# Altium project IRS_unitcell1.PrjPcb
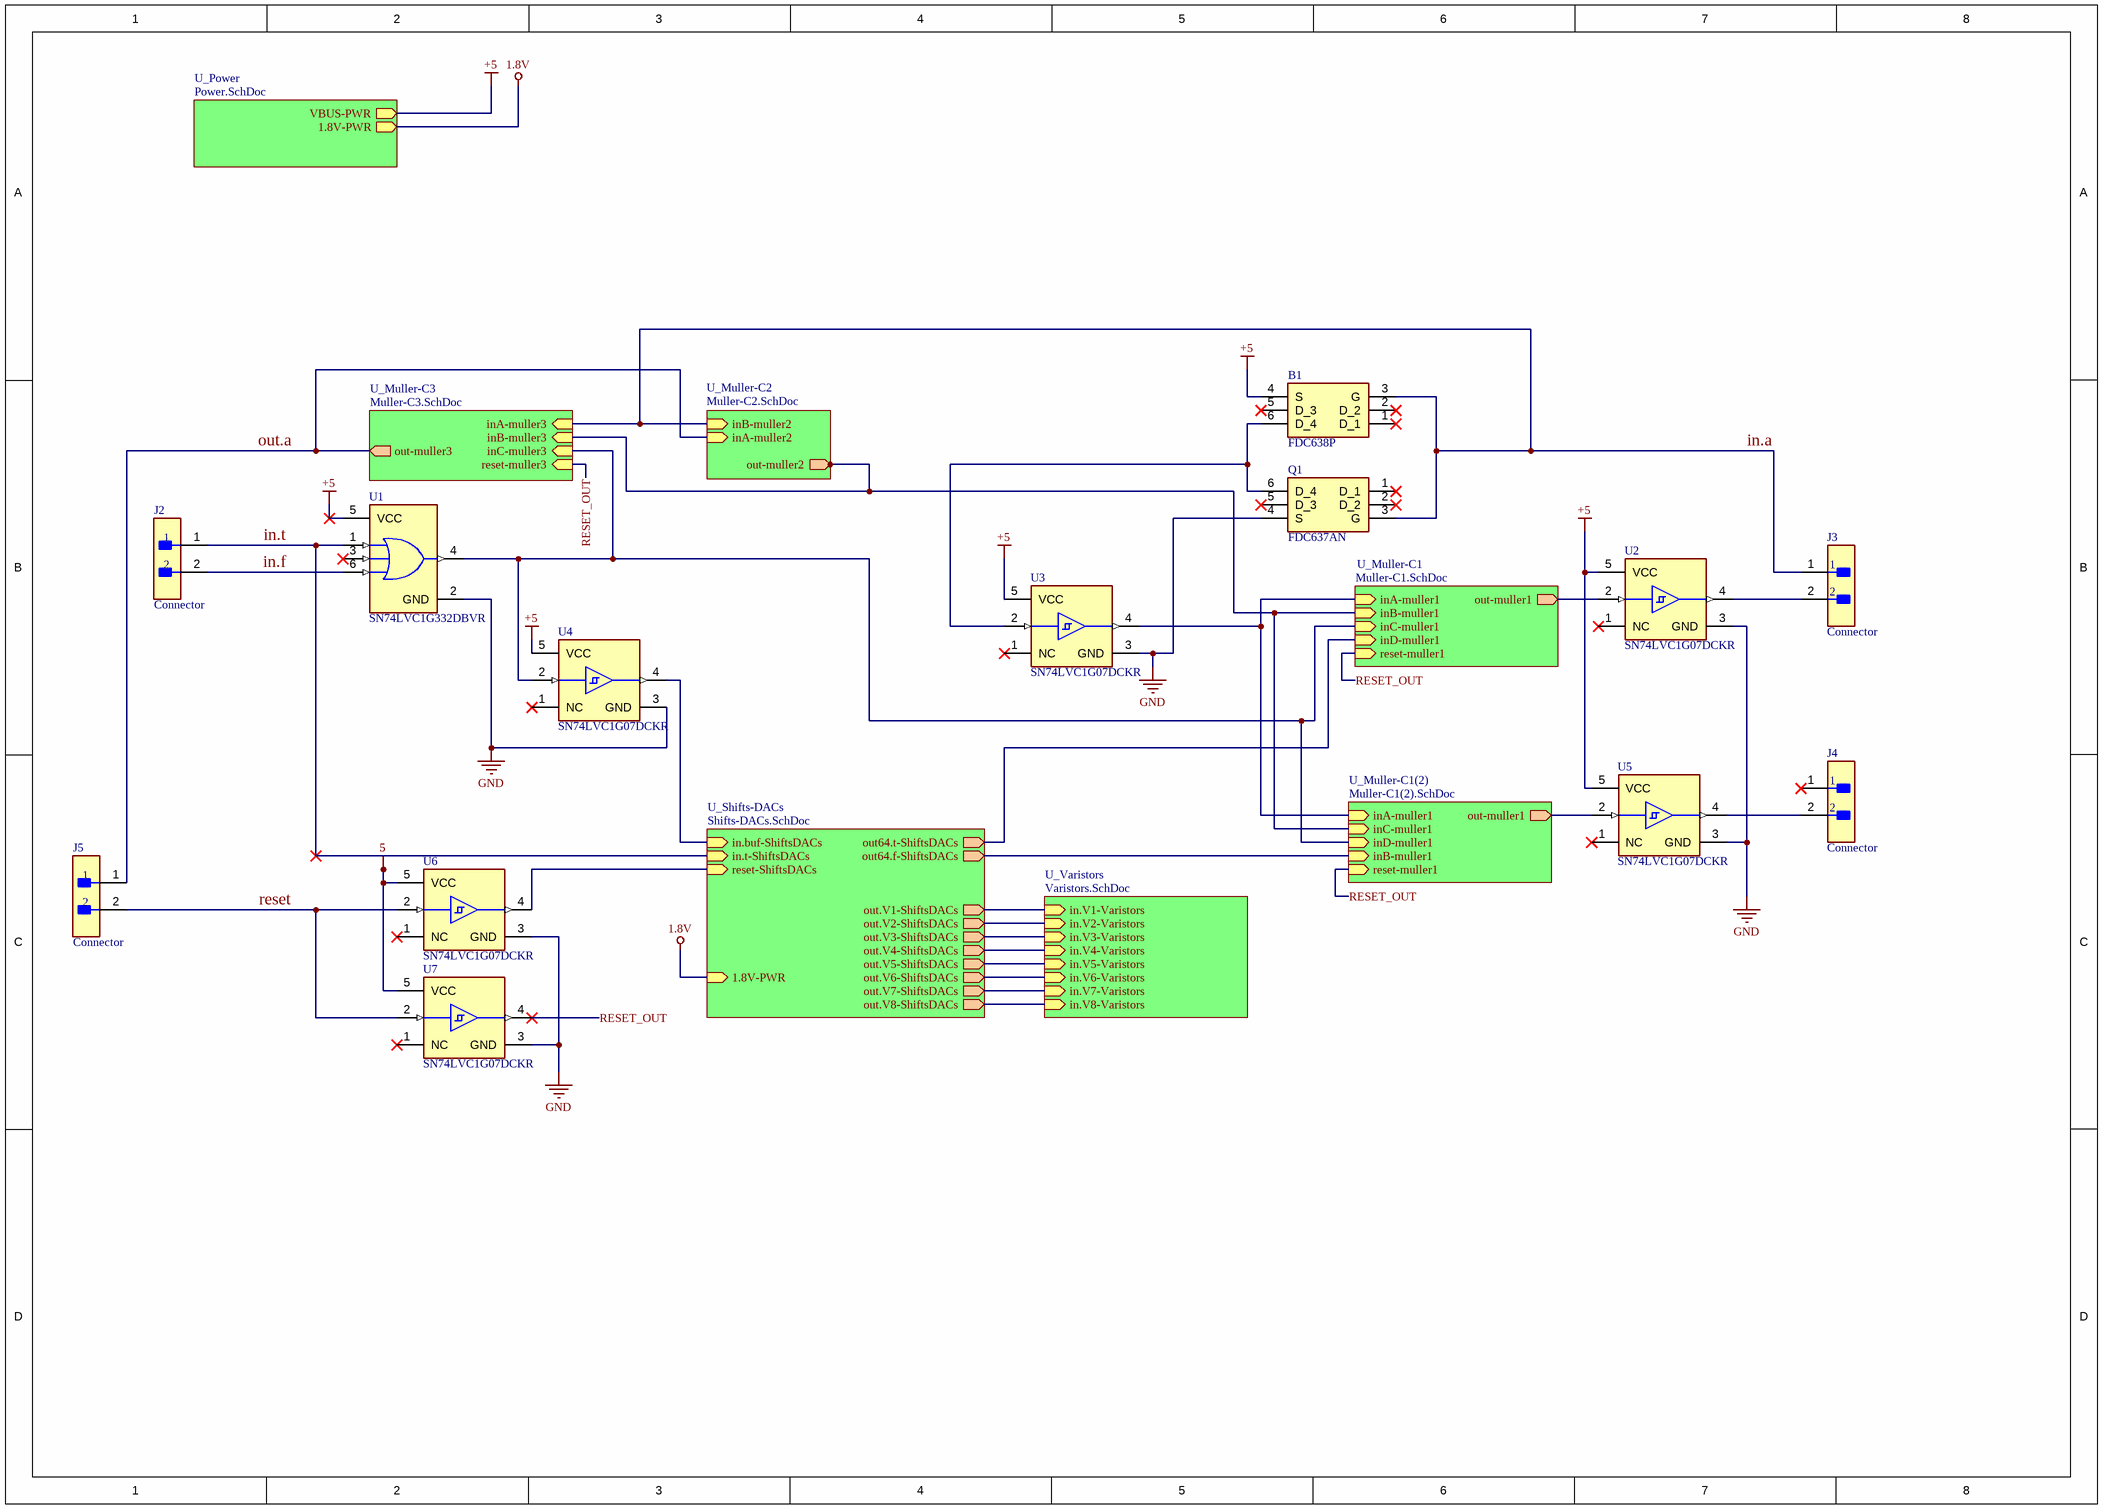
[diagram p0: Main.SchDoc]
8 sheets, 101 parts. Net scope: hierarchical (ports join the sheet entries above them; power ports are global).
Board files: IRS_ControlPCB.PcbDoc, IRS_ControlPCB - Copy.PcbDoc
Sheets:
  Main.SchDoc
    U_Muller-C1 = Muller-C1.SchDoc
    U_Muller-C2 = Muller-C2.SchDoc
    U_Muller-C3 = Muller-C3.SchDoc
    U_Shifts-DACs = Shifts-DACs.SchDoc
    U_Muller-C1(2) = Muller-C1(2).SchDoc
    U_Power = Power.SchDoc
    U_Varistors = Varistors.SchDoc

## Sheet Main.SchDoc
size A3

### Parts
B1  FDC638P  [SOT95P275X110-6N]
J2  Connector  [FP-B2B-XH-A_LF_SN-MFG]
J3  Connector  [FP-B2B-XH-A_LF_SN-MFG]
J4  Connector  [FP-B2B-XH-A_LF_SN-MFG]
J5  Connector  [FP-B2B-XH-A_LF_SN-MFG]
Q1  FDC637AN  [SOT95P275X110-6N]
U1  SN74LVC1G332DBVR  [FP-DBV0006A-MFG]
U2  SN74LVC1G07DCKR  [FP-DCK0005A-MFG]
U3  SN74LVC1G07DCKR  [FP-DCK0005A-MFG]
U4  SN74LVC1G07DCKR  [FP-DCK0005A-MFG]
U5  SN74LVC1G07DCKR  [FP-DCK0005A-MFG]
U6  SN74LVC1G07DCKR  [FP-DCK0005A-MFG]
U7  SN74LVC1G07DCKR  [FP-DCK0005A-MFG]

### Sub-sheets
U_Muller-C1 = Muller-C1.SchDoc: out-muller1 (out), inA-muller1 (in), inB-muller1 (in), inC-muller1 (in), inD-muller1 (in), reset-muller1 (in)
U_Muller-C1(2) = Muller-C1(2).SchDoc: out-muller1 (out), inA-muller1 (in), inC-muller1 (in), inD-muller1 (in), inB-muller1 (in), reset-muller1 (in)
U_Muller-C2 = Muller-C2.SchDoc: out-muller2 (out), inB-muller2 (in), inA-muller2 (in)
U_Muller-C3 = Muller-C3.SchDoc: inA-muller3 (in), inB-muller3 (in), inC-muller3 (in), out-muller3 (out), reset-muller3 (in)
U_Power = Power.SchDoc: VBUS-PWR (out), 1.8V-PWR (out)
U_Shifts-DACs = Shifts-DACs.SchDoc: in.t-ShiftsDACs (in), in.buf-ShiftsDACs (in), reset-ShiftsDACs (in), out64.t-ShiftsDACs (out), out64.f-ShiftsDACs (out), out.V1-ShiftsDACs (out), out.V2-ShiftsDACs (out), out.V3-ShiftsDACs (out), out.V4-ShiftsDACs (out), out.V5-ShiftsDACs (out), out.V6-ShiftsDACs (out), out.V7-ShiftsDACs (out), out.V8-ShiftsDACs (out), 1.8V-PWR (in)
U_Varistors = Varistors.SchDoc: in.V1-Varistors (in), in.V2-Varistors (in), in.V3-Varistors (in), in.V4-Varistors (in), in.V5-Varistors (in), in.V6-Varistors (in), in.V7-Varistors (in), in.V8-Varistors (in)

### Nets
1.8V: sheet U_Shifts-DACs/1.8V-PWR, sheet U_Power/1.8V-PWR
5: U6.5(VCC) U7.5(VCC)
+5: B1.4(S) U1.5(VCC) U2.5(VCC) U3.5(VCC) U4.5(VCC) U5.5(VCC) ; sheet U_Power/VBUS-PWR  [project net VBUS-USBC]
GND: Q1.4(S) U1.2(GND) U2.3(GND) U3.3(GND) U4.3(GND) U5.3(GND) U6.3(GND) U7.3(GND) ; sheet U_Shifts-DACs/out.V1-ShiftsDACs, sheet U_Shifts-DACs/out.V2-ShiftsDACs, sheet U_Shifts-DACs/out.V3-ShiftsDACs, sheet U_Shifts-DACs/out.V4-ShiftsDACs, sheet U_Shifts-DACs/out.V5-ShiftsDACs, sheet U_Shifts-DACs/out.V6-ShiftsDACs, sheet U_Shifts-DACs/out.V7-ShiftsDACs, sheet U_Shifts-DACs/out.V8-ShiftsDACs, sheet U_Varistors/in.V1-Varistors, sheet U_Varistors/in.V2-Varistors, sheet U_Varistors/in.V3-Varistors, sheet U_Varistors/in.V4-Varistors, sheet U_Varistors/in.V5-Varistors, sheet U_Varistors/in.V6-Varistors, sheet U_Varistors/in.V7-Varistors, sheet U_Varistors/in.V8-Varistors  [project net Dn-USBC]
in.a: B1.3(G) J3.1 Q1.3(G) ; sheet U_Muller-C2/inB-muller2, sheet U_Muller-C3/inA-muller3
in.f: J2.2 U1.6(C)
in.t: J2.1 U1.1(A) ; sheet U_Shifts-DACs/in.t-ShiftsDACs
out.a: J5.1 ; sheet U_Muller-C2/inA-muller2, sheet U_Muller-C3/out-muller3
reset: J5.2 U6.2(A) U7.2(A)
RESET_OUT: U7.4(Y) ; sheet U_Muller-C1/reset-muller1, sheet U_Muller-C3/reset-muller3, sheet U_Muller-C1(2)/reset-muller1
NetB1_6: B1.6(D_4) Q1.6(D_4) U3.2(A)
NetB2_3: U3.4(Y) ; sheet U_Muller-C1/inA-muller1, sheet U_Muller-C1(2)/inA-muller1
NetB4_3: sheet U_Muller-C1/inB-muller1, sheet U_Muller-C2/out-muller2, sheet U_Muller-C3/inB-muller3, sheet U_Muller-C1(2)/inC-muller1
NetB5_3: U2.2(A) ; sheet U_Muller-C1/out-muller1
NetB7_3: U1.4(Y) U4.2(A) ; sheet U_Muller-C1/inC-muller1, sheet U_Muller-C3/inC-muller3, sheet U_Muller-C1(2)/inD-muller1
NetB8_3: sheet U_Muller-C1/inD-muller1, sheet U_Shifts-DACs/out64.t-ShiftsDACs
NetB21_3: U6.4(Y) ; sheet U_Shifts-DACs/reset-ShiftsDACs
NetB24_3: sheet U_Shifts-DACs/out64.f-ShiftsDACs, sheet U_Muller-C1(2)/inB-muller1
NetB25_3: U5.2(A) ; sheet U_Muller-C1(2)/out-muller1
NetJ3_2: J3.2 U2.4(Y)
NetJ4_2: J4.2 U5.4(Y)
NetU4_4: U4.4(Y) ; sheet U_Shifts-DACs/in.buf-ShiftsDACs

Not connected (* = marked no-connect by the designer): B1 1(D_1)* 2(D_2)* 5(D_3)*; J4 1*; Q1 1(D_1)* 2(D_2)* 5(D_3)*; U1 3(B)*; U2 1(NC)*; U3 1(NC)*; U4 1(NC)*; U5 1(NC)*; U6 1(NC)*; U7 1(NC)*

### Library data of the parts
B1 = CMP-007-000000-1: Low gate charge (10 nC typical); Manufacturer_Name: onsemi; Geometry.Height: 1.1mm; Datasheet Link: https://www.onsemi.com/pub/Collateral/FDC638P-D.PDF; Arrow Price/Stock: *; Design Item ID: FDC638P; Mouser Part Number: 512-FDC638P; Manufacturer_Part_Number: FDC638P; Mouser Price/Stock: https://www.mouser.co.uk/ProductDetail/onsemi-Fairchild/FDC638P?qs=FOlmdCx%252BAA16kOuf%252Brkheg%3D%3D; Source: FDC638P.SchLib; Arrow Part Number: *
J2-J5 = CMP-2000-05888-3: B2B-XH-A(LF)(SN) CONN HEADER VERT 2POS 2.5MM; Current Rating: 3A; Voltage Rating: 250V; Number of Contacts: 2; Contact Resistance: 20mR; Wire/Cable Gauge: 22AWG; Insulation Resistance: 1GR; Connector Type: Male Pin; Packaging: Bulk; Contact Material: Brass; Lead Free: Lead Free; Orientation: Straight; Contact Plating: Tin; Max Current Rating: 3A; Termination: Solder; Fastening Type: Detent; Depth: 5.75mm; Housing Material: Polyamide; REACH SVHC: No SVHC; Series: XH; Voltage Rating (AC): 250V; Number of Positions: 2; Color: Natural; Contact Type: Male Pin; Max Voltage Rating (DC): 250V; Pitch: 2.5mm; Lead Pitch: 2.5mm; Mount: Through Hole; Max Operating Temperature: 85°C; Length: 7.4mm; Max Voltage Rating (AC): 250V; Min Operating Temperature: -25°C; Number of Rows: 1; Housing Color: White
Q1 = CMP-005-000000-4: Low gate charge (10.5nC typical).; Manufacturer_Name: onsemi; Geometry.Height: 1.1mm; Mouser Part Number: 512-FDC637AN; Source: FDC637AN.SchLib; Arrow Part Number: FDC637AN; Datasheet Link: https://www.onsemi.com/pub/Collateral/FDC637AN-D.PDF; Arrow Price/Stock: https://www.arrow.com/en/products/fdc637an/on-semiconductor?region=nac; Manufacturer_Part_Number: FDC637AN; Mouser Price/Stock: https://www.mouser.co.uk/ProductDetail/ON-Semiconductor-Fairchild/FDC637AN?qs=utFvTgNEmG6iAEUdTAueXw%3D%3D; Design Item ID: FDC637AN
U1 = CMP-0859-00188-4: IC GATE OR 1CH 3-INP SOT23-6; Manufacturer: TEXAS INSTRUMENTS; Number Of Inputs: 3; Nominal Supply Current: 10-500uA; Number Of Circuits: 1; Max Supply Voltage: 5.5V; Standoff Height: 0mm; Propagation Delay: 4.5ns; Min Supply Voltage: 1.5V; Height: 1.45mm; Temperature Range High: +125°C; Device Class L3: Logic Gates; Device Class L2: Logic ICs; Lead Free: Yes; Temperature Range Low: -40°C; ComponentLink2URL: http://www.ti.com/lit/ds/symlink/sn74lvc1g332.pdf; Package: DBV0006A; ComponentLink2Description: Datasheet; Octopart: https://octopart.com/sn74lvc1g332dbvr-texas+instruments-464996; Category: IC; Automotive: No; Manufacturer Part Number: SN74LVC1G332DBVR; Ipc Land Pattern Name: SOT95P280X145-6; Logic Function Desc: OR; Ambient Temperature Range Low: -40°C; Temperature: -40°C to +125°C; Number Of Outputs: 1; Mouser Description: Logic Gates Sngl 3 Inpt + OR Gt; RoHS: TRUE; Ambient Temperature Range High: +125°C; Device Class L1: Integrated Circuits (ICs); Digikey Description: IC GATE OR 1CH 3-INP SOT23-6
U2-U7 = CMP-00023-00004-1: Buffer, LVC/LCX/Z Series, 1-Func, 1-Input, CMOS, PDSO5; Min Operating Temperature: -40°C; Pins: 5; Case/Package: TSSOP; Max Operating Temperature: 125°C; RoHS Compliant: Yes

## Sheet Muller-C1.SchDoc
size 429 x 344 mm
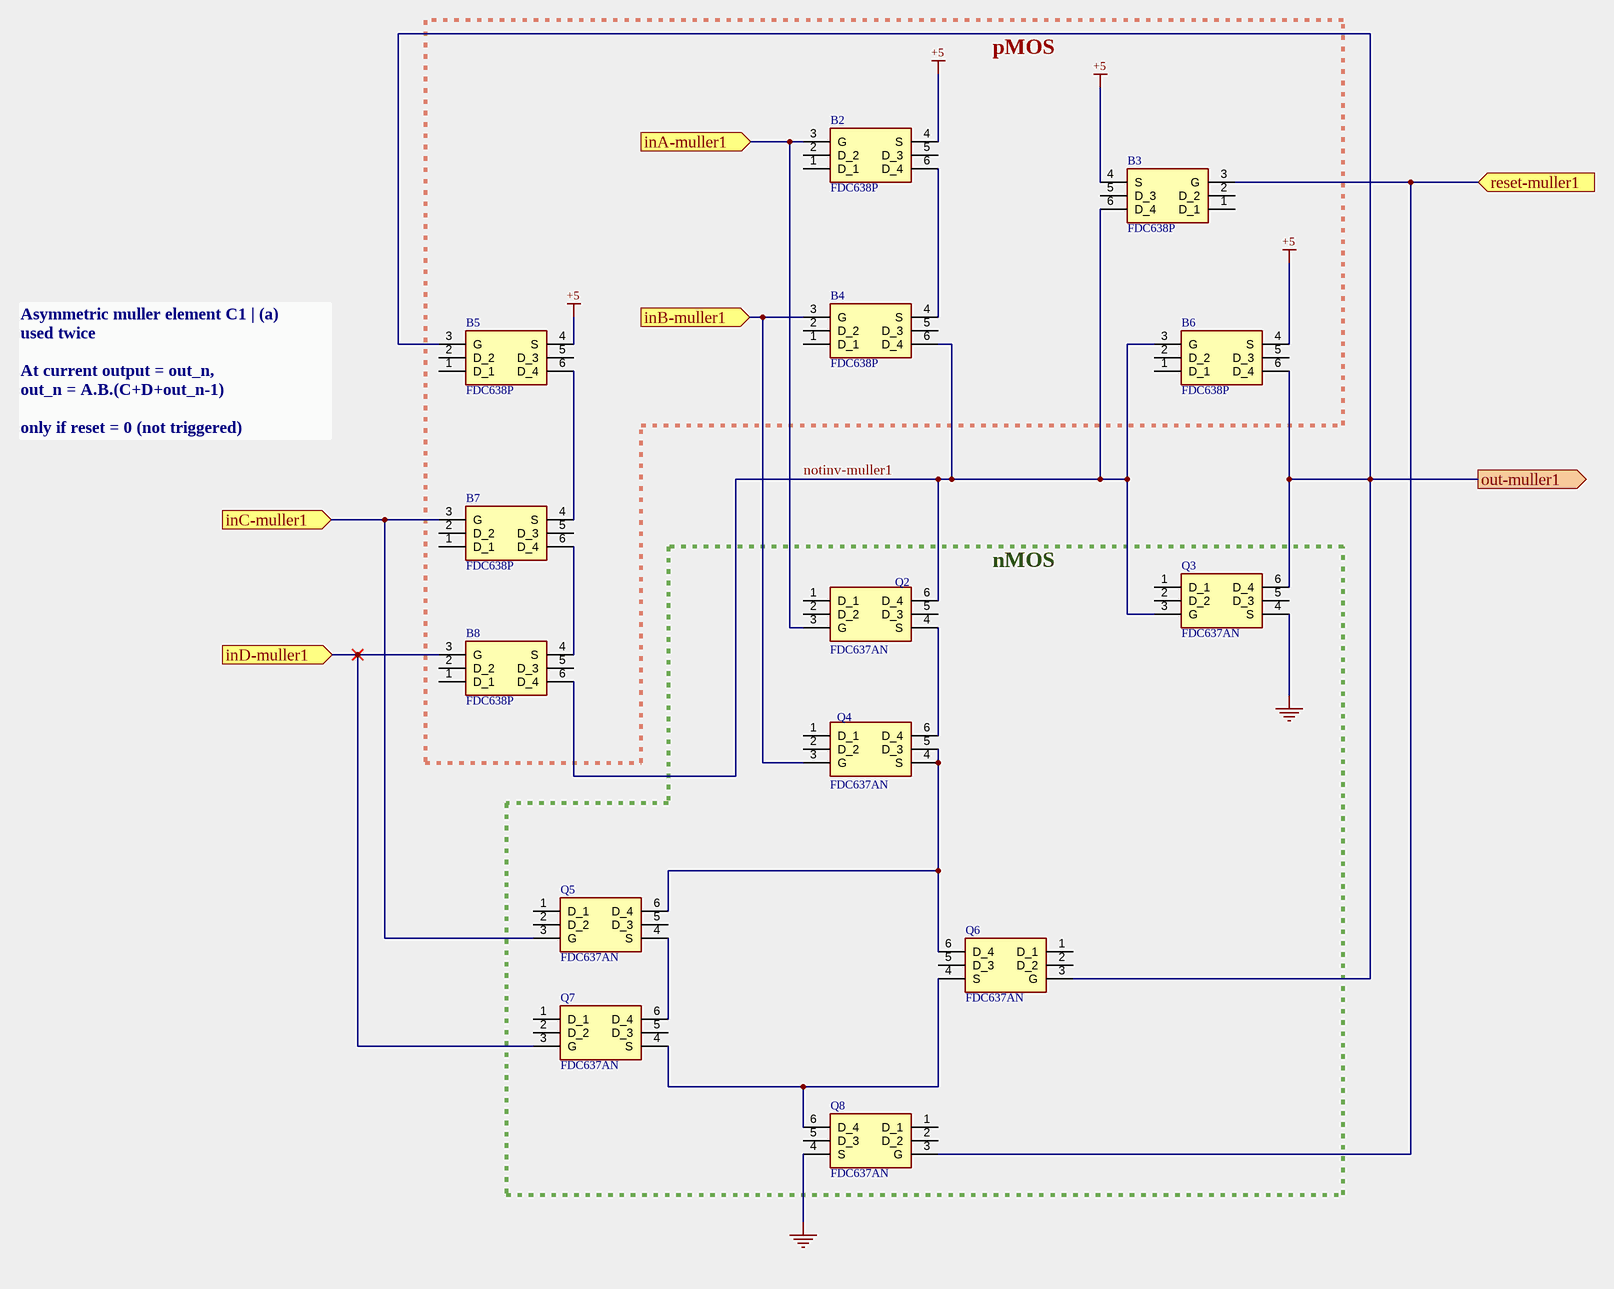
[diagram p1: Muller-C1.SchDoc]

### Parts
B2  FDC638P  [SOT95P275X110-6N]
B3  FDC638P  [SOT95P275X110-6N]
B4  FDC638P  [SOT95P275X110-6N]
B5  FDC638P  [SOT95P275X110-6N]
B6  FDC638P  [SOT95P275X110-6N]
B7  FDC638P  [SOT95P275X110-6N]
B8  FDC638P  [SOT95P275X110-6N]
Q2  FDC637AN  [SOT95P275X110-6N]
Q3  FDC637AN  [SOT95P275X110-6N]
Q4  FDC637AN  [SOT95P275X110-6N]
Q5  FDC637AN  [SOT95P275X110-6N]
Q6  FDC637AN  [SOT95P275X110-6N]
Q7  FDC637AN  [SOT95P275X110-6N]
Q8  FDC637AN  [SOT95P275X110-6N]

### Blocks framed on the sheet
pMOS: B2-B8
nMOS: Q2-Q8

### Ports
inA-muller1 (in), inB-muller1 (in), inC-muller1 (in), inD-muller1 (in), out-muller1 (out), reset-muller1 (in)

### Nets
+5: B2.4(S) B3.4(S) B5.4(S) B6.4(S)  [project net VBUS-USBC]
GND: Q3.4(S) Q8.4(S)  [project net Dn-USBC]
notinv-muller1: B3.6(D_4) B4.6(D_4) B6.3(G) B8.6(D_4) Q2.6(D_4) Q3.3(G)
RESET_OUT: B3.3(G) Q8.3(G) ; port reset-muller1
NetB2_3: B2.3(G) Q2.3(G) ; port inA-muller1
NetB2_6: B2.6(D_4) B4.4(S)
NetB4_3: B4.3(G) Q4.3(G) ; port inB-muller1
NetB5_3: B5.3(G) B6.6(D_4) Q3.6(D_4) Q6.3(G) ; port out-muller1
NetB5_6: B5.6(D_4) B7.4(S)
NetB7_3: B7.3(G) Q5.3(G) ; port inC-muller1
NetB7_6: B7.6(D_4) B8.4(S)
NetB8_3: B8.3(G) Q7.3(G) ; port inD-muller1
NetQ2_4: Q2.4(S) Q4.6(D_4)
NetQ4_4: Q4.4(S) Q4.5(D_3) Q5.6(D_4) Q6.6(D_4)
NetQ5_4: Q5.4(S) Q7.6(D_4)
NetQ6_4: Q6.4(S) Q7.4(S) Q8.6(D_4)

Not connected (* = marked no-connect by the designer): B2 1(D_1) 2(D_2) 5(D_3); B3 1(D_1) 2(D_2) 5(D_3); B4 1(D_1) 2(D_2) 5(D_3); B5 1(D_1) 2(D_2) 5(D_3); B6 1(D_1) 2(D_2) 5(D_3); B7 1(D_1) 2(D_2) 5(D_3); B8 1(D_1) 2(D_2) 5(D_3); Q2 1(D_1) 2(D_2) 5(D_3); Q3 1(D_1) 2(D_2) 5(D_3); Q4 1(D_1) 2(D_2); Q5 1(D_1) 2(D_2) 5(D_3); Q6 1(D_1) 2(D_2) 5(D_3); Q7 1(D_1) 2(D_2) 5(D_3); Q8 1(D_1) 2(D_2) 5(D_3)

### Notes on the sheet
- Asymmetric muller element C1 | (a)
  used twice
  At current output = out_n,
  out_n = A.B.(C+D+out_n-1)
  only if reset = 0 (not triggered)

### Library data of the parts
B2-B8 = CMP-007-000000-1: as B1 on sheet Main; Datasheet Link: https://www.onsemi.com/pub/Collateral/FDC638P-D.PDF; Arrow Price/Stock: *; Design Item ID: FDC638P; Mouser Part Number: 512-FDC638P; Manufacturer_Part_Number: FDC638P; Mouser Price/Stock: https://www.mouser.co.uk/ProductDetail/onsemi-Fairchild/FDC638P?qs=FOlmdCx%252BAA16kOuf%252Brkheg%3D%3D; Source: FDC638P.SchLib; Arrow Part Number: *
Q2-Q8 = CMP-005-000000-4: as Q1 on sheet Main; Mouser Part Number: 512-FDC637AN; Source: FDC637AN.SchLib; Arrow Part Number: FDC637AN; Datasheet Link: https://www.onsemi.com/pub/Collateral/FDC637AN-D.PDF; Arrow Price/Stock: https://www.arrow.com/en/products/fdc637an/on-semiconductor?region=nac; Manufacturer_Part_Number: FDC637AN; Mouser Price/Stock: https://www.mouser.co.uk/ProductDetail/ON-Semiconductor-Fairchild/FDC637AN?qs=utFvTgNEmG6iAEUdTAueXw%3D%3D; Design Item ID: FDC637AN

## Sheet Muller-C2.SchDoc
size 419 x 208 mm
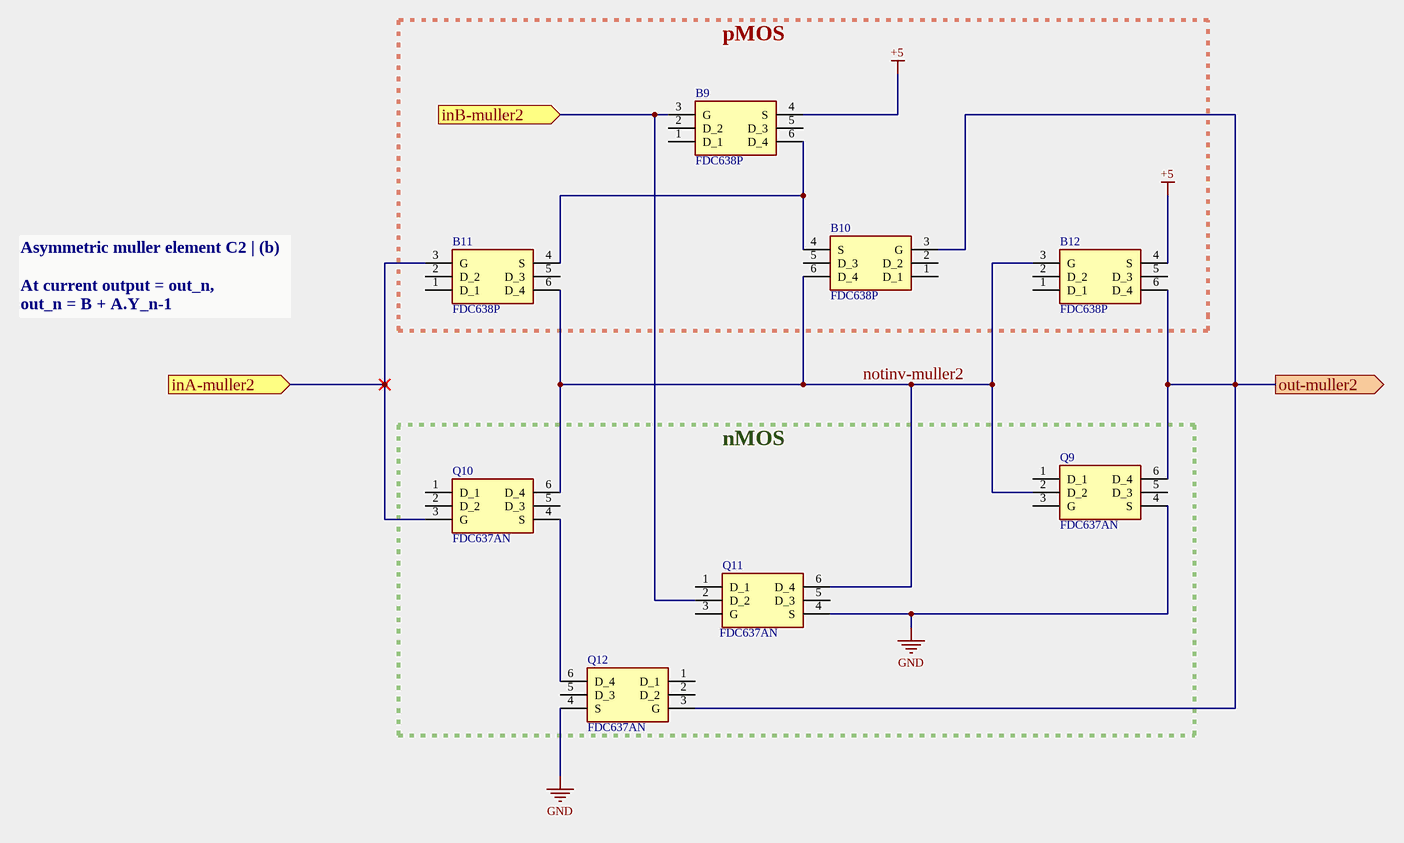
[diagram p2: Muller-C2.SchDoc]

### Parts
B9  FDC638P  [SOT95P275X110-6N]
B10  FDC638P  [SOT95P275X110-6N]
B11  FDC638P  [SOT95P275X110-6N]
B12  FDC638P  [SOT95P275X110-6N]
Q9  FDC637AN  [SOT95P275X110-6N]
Q10  FDC637AN  [SOT95P275X110-6N]
Q11  FDC637AN  [SOT95P275X110-6N]
Q12  FDC637AN  [SOT95P275X110-6N]

### Blocks framed on the sheet
pMOS: B9-B12
nMOS: Q9-Q12

### Ports
inA-muller2 (in), inB-muller2 (in), out-muller2 (out)

### Nets
+5: B9.4(S) B12.4(S)  [project net VBUS-USBC]
GND: Q9.4(S) Q11.4(S) Q12.4(S)  [project net Dn-USBC]
in.a: B9.3(G) Q11.2(D_2) ; port inB-muller2
notinv-muller2: B10.6(D_4) B11.6(D_4) B12.3(G) Q9.2(D_2) Q10.6(D_4) Q11.6(D_4)
out.a: B11.3(G) Q10.3(G) ; port inA-muller2
NetB4_3: B10.3(G) B12.6(D_4) Q9.6(D_4) Q12.3(G) ; port out-muller2
NetB9_6: B9.6(D_4) B10.4(S) B11.4(S)
NetQ10_4: Q10.4(S) Q12.6(D_4)

Not connected (* = marked no-connect by the designer): B9 1(D_1) 2(D_2) 5(D_3); B10 1(D_1) 2(D_2) 5(D_3); B11 1(D_1) 2(D_2) 5(D_3); B12 1(D_1) 2(D_2) 5(D_3); Q9 1(D_1) 3(G) 5(D_3); Q10 1(D_1) 2(D_2) 5(D_3); Q11 1(D_1) 3(G) 5(D_3); Q12 1(D_1) 2(D_2) 5(D_3)

### Notes on the sheet
- Asymmetric muller element C2 | (b)
  At current output = out_n,
  out_n = B + A.Y_n-1

### Library data of the parts
B9-B12 = CMP-007-000000-1: as B1 on sheet Main; Datasheet Link: https://www.onsemi.com/pub/Collateral/FDC638P-D.PDF; Arrow Price/Stock: *; Design Item ID: FDC638P; Mouser Part Number: 512-FDC638P; Manufacturer_Part_Number: FDC638P; Mouser Price/Stock: https://www.mouser.co.uk/ProductDetail/onsemi-Fairchild/FDC638P?qs=FOlmdCx%252BAA16kOuf%252Brkheg%3D%3D; Source: FDC638P.SchLib; Arrow Part Number: *
Q9-Q12 = CMP-005-000000-4: as Q1 on sheet Main; Mouser Part Number: 512-FDC637AN; Source: FDC637AN.SchLib; Arrow Part Number: FDC637AN; Datasheet Link: https://www.onsemi.com/pub/Collateral/FDC637AN-D.PDF; Arrow Price/Stock: https://www.arrow.com/en/products/fdc637an/on-semiconductor?region=nac; Manufacturer_Part_Number: FDC637AN; Mouser Price/Stock: https://www.mouser.co.uk/ProductDetail/ON-Semiconductor-Fairchild/FDC637AN?qs=utFvTgNEmG6iAEUdTAueXw%3D%3D; Design Item ID: FDC637AN

## Sheet Muller-C3.SchDoc
size 425 x 409 mm
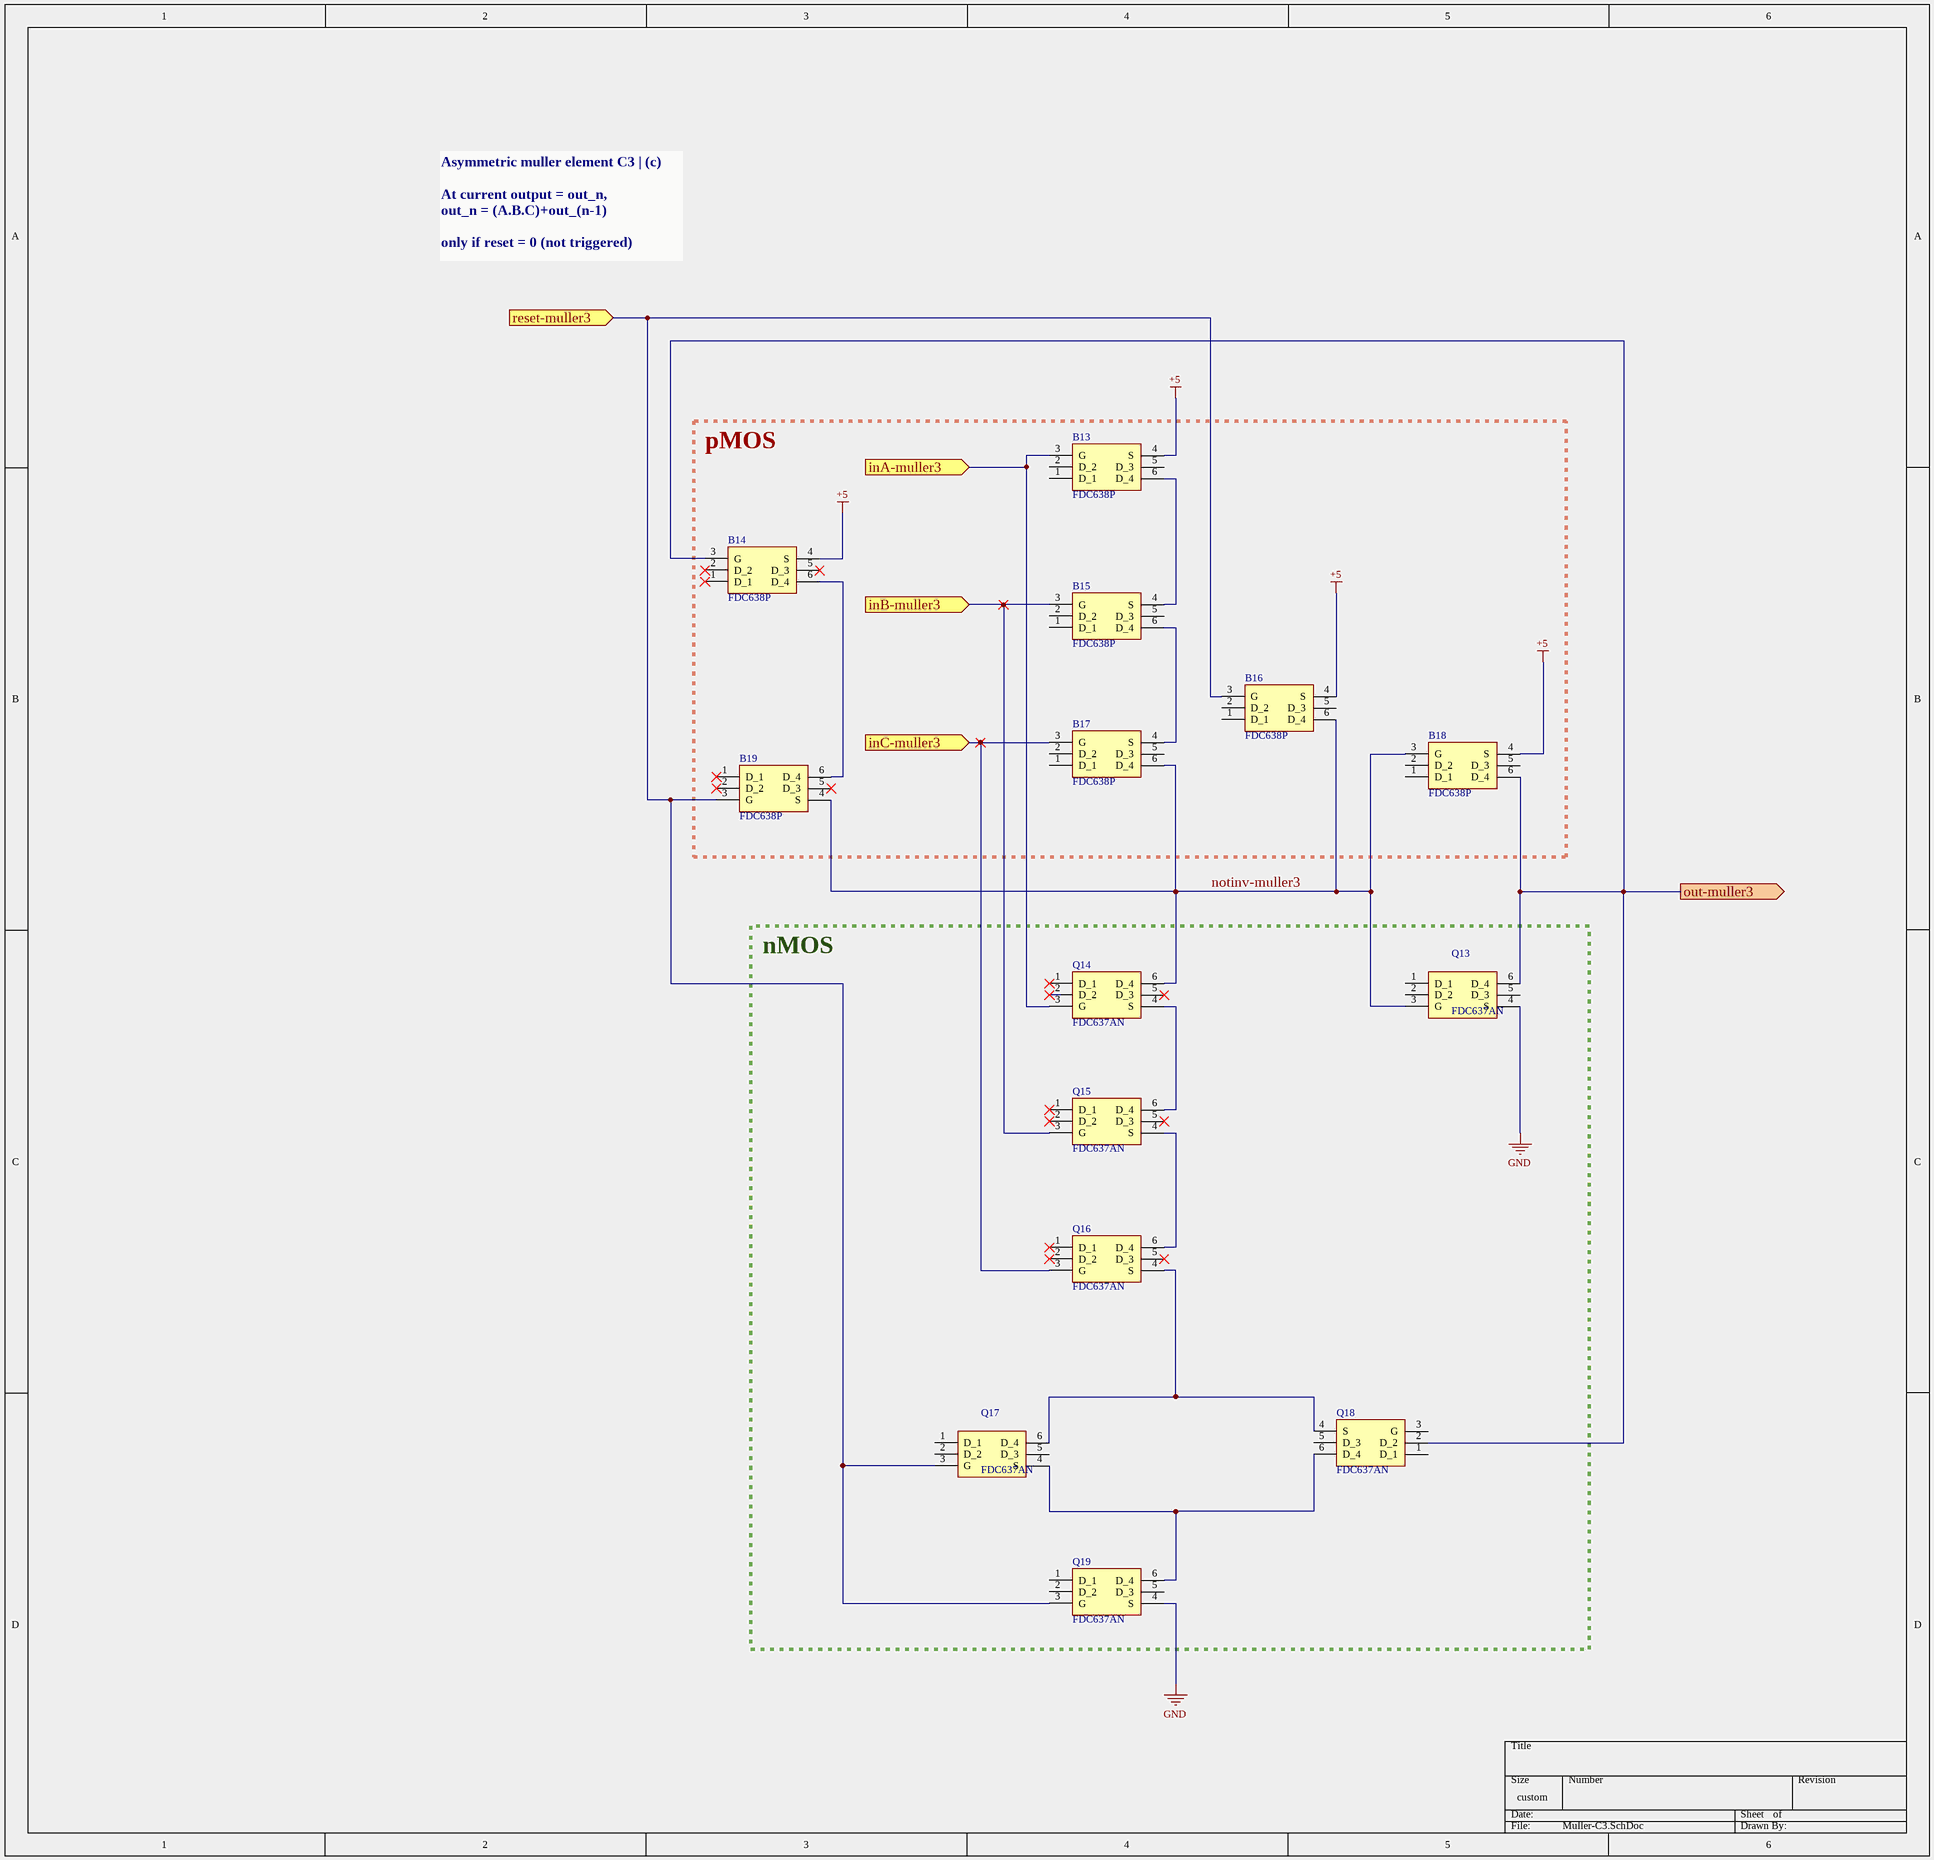
[diagram p3: Muller-C3.SchDoc]

### Parts
B13  FDC638P  [SOT95P275X110-6N]
B14  FDC638P  [SOT95P275X110-6N]
B15  FDC638P  [SOT95P275X110-6N]
B16  FDC638P  [SOT95P275X110-6N]
B17  FDC638P  [SOT95P275X110-6N]
B18  FDC638P  [SOT95P275X110-6N]
B19  FDC638P  [SOT95P275X110-6N]
Q13  FDC637AN  [SOT95P275X110-6N]
Q14  FDC637AN  [SOT95P275X110-6N]
Q15  FDC637AN  [SOT95P275X110-6N]
Q16  FDC637AN  [SOT95P275X110-6N]
Q17  FDC637AN  [SOT95P275X110-6N]
Q18  FDC637AN  [SOT95P275X110-6N]
Q19  FDC637AN  [SOT95P275X110-6N]

### Blocks framed on the sheet
pMOS: B13-B19
nMOS: Q13-Q19

### Ports
inA-muller3 (in), inB-muller3 (in), inC-muller3 (in), out-muller3 (out), reset-muller3 (in)

### Nets
+5: B13.4(S) B14.4(S) B16.4(S) B18.4(S)  [project net VBUS-USBC]
GND: Q13.4(S) Q19.4(S)  [project net Dn-USBC]
in.a: B13.3(G) Q14.3(G) ; port inA-muller3
notinv-muller3: B16.6(D_4) B17.6(D_4) B18.3(G) B19.4(S) Q13.3(G) Q14.6(D_4)
out.a: B14.3(G) B18.6(D_4) Q13.6(D_4) Q18.2(D_2) ; port out-muller3
RESET_OUT: B16.3(G) B19.3(G) Q17.3(G) Q19.3(G) ; port reset-muller3
NetB4_3: B15.3(G) Q15.3(G) ; port inB-muller3
NetB7_3: B17.3(G) Q16.3(G) ; port inC-muller3
NetB13_6: B13.6(D_4) B15.4(S)
NetB14_6: B14.6(D_4) B19.6(D_4)
NetB15_6: B15.6(D_4) B17.4(S)
NetQ14_4: Q14.4(S) Q15.6(D_4)
NetQ15_4: Q15.4(S) Q16.6(D_4)
NetQ16_4: Q16.4(S) Q17.6(D_4) Q18.4(S)
NetQ17_4: Q17.4(S) Q18.6(D_4) Q19.6(D_4)

Not connected (* = marked no-connect by the designer): B13 1(D_1) 2(D_2) 5(D_3); B14 1(D_1)* 2(D_2)* 5(D_3)*; B15 1(D_1) 2(D_2) 5(D_3); B16 1(D_1) 2(D_2) 5(D_3); B17 1(D_1) 2(D_2) 5(D_3); B18 1(D_1) 2(D_2) 5(D_3); B19 1(D_1)* 2(D_2)* 5(D_3)*; Q13 1(D_1) 2(D_2) 5(D_3); Q14 1(D_1)* 2(D_2)* 5(D_3)*; Q15 1(D_1)* 2(D_2)* 5(D_3)*; Q16 1(D_1)* 2(D_2)* 5(D_3)*; Q17 1(D_1) 2(D_2) 5(D_3); Q18 1(D_1) 3(G) 5(D_3); Q19 1(D_1) 2(D_2) 5(D_3)

### Notes on the sheet
- Asymmetric muller element C3 | (c)
  At current output = out_n,
  out_n = (A.B.C)+out_(n-1)
  only if reset = 0 (not triggered)

### Library data of the parts
B13-B19 = CMP-007-000000-1: as B1 on sheet Main; Datasheet Link: https://www.onsemi.com/pub/Collateral/FDC638P-D.PDF; Arrow Price/Stock: *; Design Item ID: FDC638P; Mouser Part Number: 512-FDC638P; Manufacturer_Part_Number: FDC638P; Mouser Price/Stock: https://www.mouser.co.uk/ProductDetail/onsemi-Fairchild/FDC638P?qs=FOlmdCx%252BAA16kOuf%252Brkheg%3D%3D; Source: FDC638P.SchLib; Arrow Part Number: *
Q13-Q19 = CMP-005-000000-4: as Q1 on sheet Main; Mouser Part Number: 512-FDC637AN; Source: FDC637AN.SchLib; Arrow Part Number: FDC637AN; Datasheet Link: https://www.onsemi.com/pub/Collateral/FDC637AN-D.PDF; Arrow Price/Stock: https://www.arrow.com/en/products/fdc637an/on-semiconductor?region=nac; Manufacturer_Part_Number: FDC637AN; Mouser Price/Stock: https://www.mouser.co.uk/ProductDetail/ON-Semiconductor-Fairchild/FDC637AN?qs=utFvTgNEmG6iAEUdTAueXw%3D%3D; Design Item ID: FDC637AN

## Sheet Shifts-DACs.SchDoc
size A2
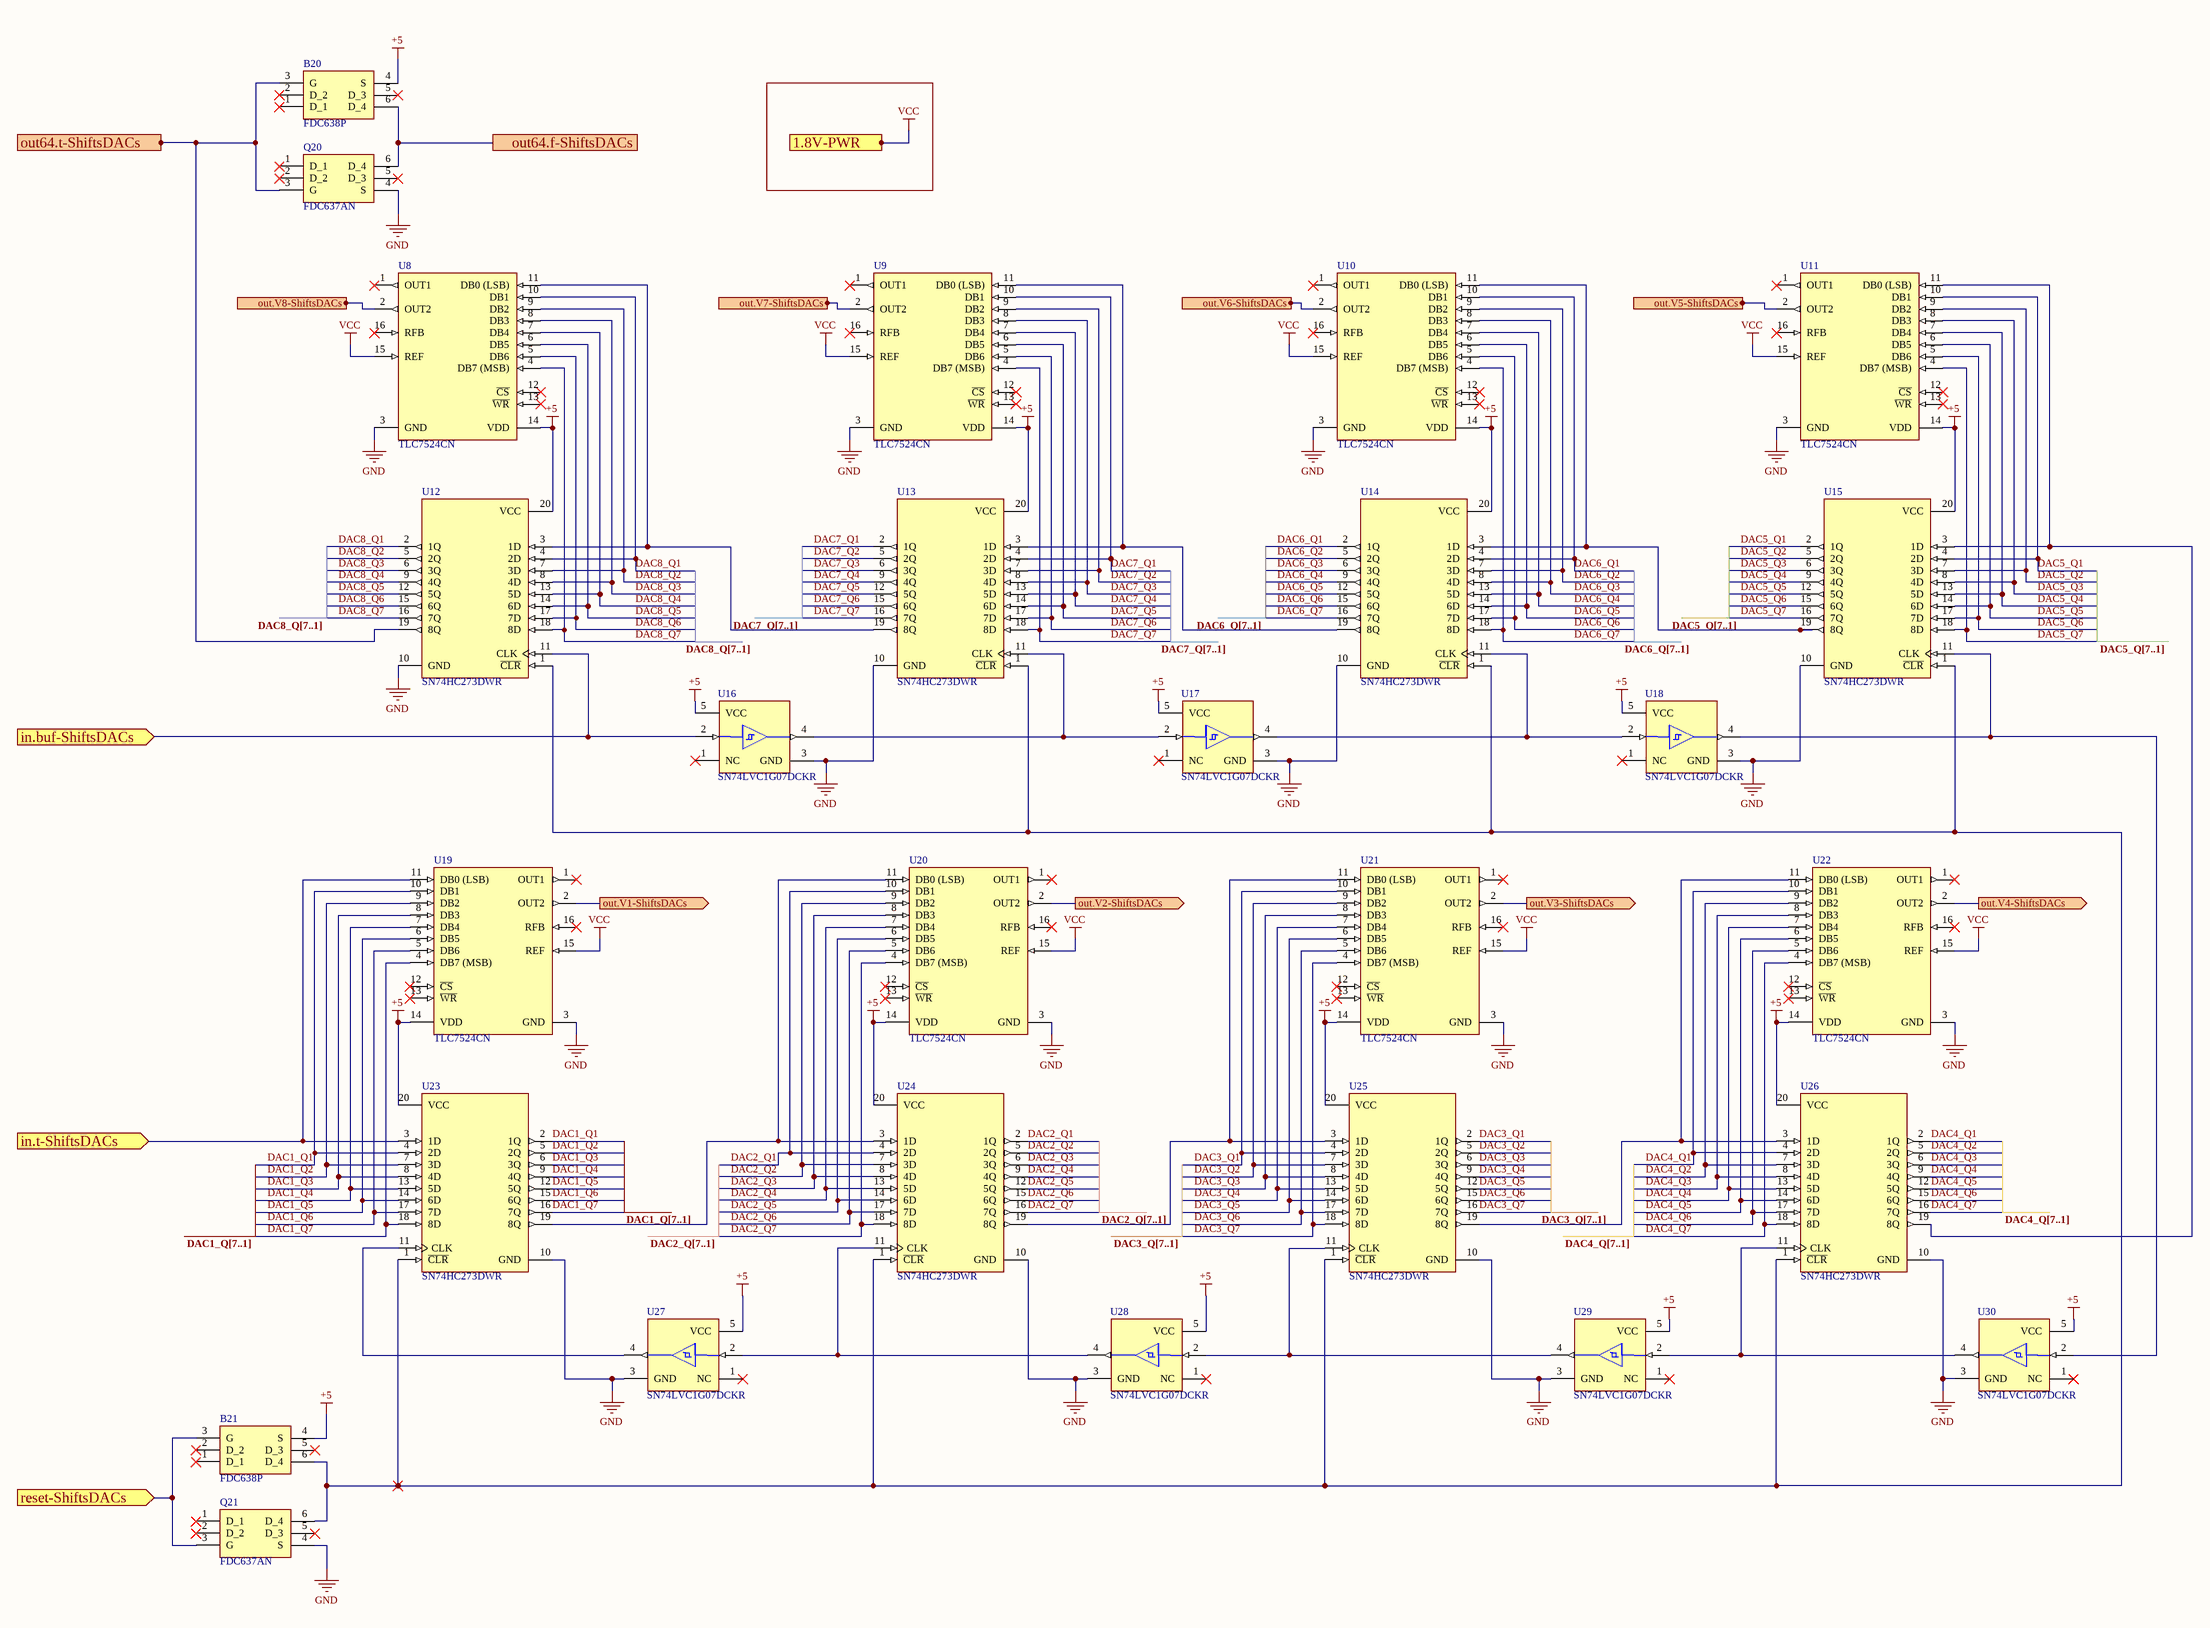
[diagram p4: Shifts-DACs.SchDoc]

### Parts
B20  FDC638P  [SOT95P275X110-6N]
B21  FDC638P  [SOT95P275X110-6N]
Q20  FDC637AN  [SOT95P275X110-6N]
Q21  FDC637AN  [SOT95P275X110-6N]
U8  TLC7524CN  [TI-N16]
U9  TLC7524CN  [TI-N16]
U10  TLC7524CN  [TI-N16]
U11  TLC7524CN  [TI-N16]
U12  SN74HC273DWR  [FP-DW0020A-IPC_A]
U13  SN74HC273DWR  [FP-DW0020A-IPC_A]
U14  SN74HC273DWR  [FP-DW0020A-IPC_A]
U15  SN74HC273DWR  [FP-DW0020A-IPC_A]
U16  SN74LVC1G07DCKR  [FP-DCK0005A-MFG]
U17  SN74LVC1G07DCKR  [FP-DCK0005A-MFG]
U18  SN74LVC1G07DCKR  [FP-DCK0005A-MFG]
U19  TLC7524CN  [TI-N16]
U20  TLC7524CN  [TI-N16]
U21  TLC7524CN  [TI-N16]
U22  TLC7524CN  [TI-N16]
U23  SN74HC273DWR  [FP-DW0020A-IPC_A]
U24  SN74HC273DWR  [FP-DW0020A-IPC_A]
U25  SN74HC273DWR  [FP-DW0020A-IPC_A]
U26  SN74HC273DWR  [FP-DW0020A-IPC_A]
U27  SN74LVC1G07DCKR  [FP-DCK0005A-MFG]
U28  SN74LVC1G07DCKR  [FP-DCK0005A-MFG]
U29  SN74LVC1G07DCKR  [FP-DCK0005A-MFG]
U30  SN74LVC1G07DCKR  [FP-DCK0005A-MFG]

### Ports
1.8V-PWR (in), in.buf-ShiftsDACs (in), in.t-ShiftsDACs (in), out64.f-ShiftsDACs (out), out64.t-ShiftsDACs (out), out.V1-ShiftsDACs (out), out.V2-ShiftsDACs (out), out.V3-ShiftsDACs (out), out.V4-ShiftsDACs (out), out.V5-ShiftsDACs (out), out.V6-ShiftsDACs (out), out.V7-ShiftsDACs (out), out.V8-ShiftsDACs (out), reset-ShiftsDACs (in)

### Nets
+5: B20.4(S) B21.4(S) U8.14(VDD) U9.14(VDD) U10.14(VDD) U11.14(VDD) U12.20(VCC) U13.20(VCC) U14.20(VCC) U15.20(VCC) U16.5(VCC) U17.5(VCC) U18.5(VCC) U19.14(VDD) U20.14(VDD) U21.14(VDD) U22.14(VDD) U23.20(VCC) U24.20(VCC) U25.20(VCC) U26.20(VCC) U27.5(VCC) U28.5(VCC) U29.5(VCC) U30.5(VCC)  [project net VBUS-USBC]
GND: Q20.4(S) Q21.4(S) U8.2(OUT2) U8.3(GND) U9.2(OUT2) U9.3(GND) U10.2(OUT2) U10.3(GND) U11.2(OUT2) U11.3(GND) U12.10(GND) U13.10(GND) U14.10(GND) U15.10(GND) U16.3(GND) U17.3(GND) U18.3(GND) U19.2(OUT2) U19.3(GND) U20.2(OUT2) U20.3(GND) U21.2(OUT2) U21.3(GND) U22.2(OUT2) U22.3(GND) U23.10(GND) U24.10(GND) U25.10(GND) U26.10(GND) U27.3(GND) U28.3(GND) U29.3(GND) U30.3(GND) ; port out.V1-ShiftsDACs, port out.V2-ShiftsDACs, port out.V3-ShiftsDACs, port out.V4-ShiftsDACs, port out.V5-ShiftsDACs, port out.V6-ShiftsDACs, port out.V7-ShiftsDACs, port out.V8-ShiftsDACs  [project net Dn-USBC]
VCC: U8.15(REF) U9.15(REF) U10.15(REF) U11.15(REF) U19.15(REF) U20.15(REF) U21.15(REF) U22.15(REF) ; port 1.8V-PWR  [project net 1.8V]
DAC1_Q1: U19.10(DB1) U23.2(1Q) U23.4(2D)
DAC1_Q2: U19.9(DB2) U23.5(2Q) U23.7(3D)
DAC1_Q3: U19.8(DB3) U23.6(3Q) U23.8(4D)
DAC1_Q4: U19.7(DB4) U23.9(4Q) U23.13(5D)
DAC1_Q5: U19.6(DB5) U23.12(5Q) U23.14(6D)
DAC1_Q6: U19.5(DB6) U23.15(6Q) U23.17(7D)
DAC1_Q7: U19.4(DB7_(MSB)) U23.16(7Q) U23.18(8D)
DAC2_Q1: U20.10(DB1) U24.2(1Q) U24.4(2D)
DAC2_Q2: U20.9(DB2) U24.5(2Q) U24.7(3D)
DAC2_Q3: U20.8(DB3) U24.6(3Q) U24.8(4D)
DAC2_Q4: U20.7(DB4) U24.9(4Q) U24.13(5D)
DAC2_Q5: U20.6(DB5) U24.12(5Q) U24.14(6D)
DAC2_Q6: U20.5(DB6) U24.15(6Q) U24.17(7D)
DAC2_Q7: U20.4(DB7_(MSB)) U24.16(7Q) U24.18(8D)
DAC3_Q1: U21.10(DB1) U25.2(1Q) U25.4(2D)
DAC3_Q2: U21.9(DB2) U25.5(2Q) U25.7(3D)
DAC3_Q3: U21.8(DB3) U25.6(3Q) U25.8(4D)
DAC3_Q4: U21.7(DB4) U25.9(4Q) U25.13(5D)
DAC3_Q5: U21.6(DB5) U25.12(5Q) U25.14(6D)
DAC3_Q6: U21.5(DB6) U25.15(6Q) U25.17(7D)
DAC3_Q7: U21.4(DB7_(MSB)) U25.16(7Q) U25.18(8D)
DAC4_Q1: U22.10(DB1) U26.2(1Q) U26.4(2D)
DAC4_Q2: U22.9(DB2) U26.5(2Q) U26.7(3D)
DAC4_Q3: U22.8(DB3) U26.6(3Q) U26.8(4D)
DAC4_Q4: U22.7(DB4) U26.9(4Q) U26.13(5D)
DAC4_Q5: U22.6(DB5) U26.12(5Q) U26.14(6D)
DAC4_Q6: U22.5(DB6) U26.15(6Q) U26.17(7D)
DAC4_Q7: U22.4(DB7_(MSB)) U26.16(7Q) U26.18(8D)
DAC5_Q1: U11.10(DB1) U15.2(1Q) U15.4(2D)
DAC5_Q2: U11.9(DB2) U15.5(2Q) U15.7(3D)
DAC5_Q3: U11.8(DB3) U15.6(3Q) U15.8(4D)
DAC5_Q4: U11.7(DB4) U15.9(4Q) U15.13(5D)
DAC5_Q5: U11.6(DB5) U15.12(5Q) U15.14(6D)
DAC5_Q6: U11.5(DB6) U15.15(6Q) U15.17(7D)
DAC5_Q7: U11.4(DB7_(MSB)) U15.16(7Q) U15.18(8D)
DAC6_Q1: U10.10(DB1) U14.2(1Q) U14.4(2D)
DAC6_Q2: U10.9(DB2) U14.5(2Q) U14.7(3D)
DAC6_Q3: U10.8(DB3) U14.6(3Q) U14.8(4D)
DAC6_Q4: U10.7(DB4) U14.9(4Q) U14.13(5D)
DAC6_Q5: U10.6(DB5) U14.12(5Q) U14.14(6D)
DAC6_Q6: U10.5(DB6) U14.15(6Q) U14.17(7D)
DAC6_Q7: U10.4(DB7_(MSB)) U14.16(7Q) U14.18(8D)
DAC7_Q1: U9.10(DB1) U13.2(1Q) U13.4(2D)
DAC7_Q2: U9.9(DB2) U13.5(2Q) U13.7(3D)
DAC7_Q3: U9.8(DB3) U13.6(3Q) U13.8(4D)
DAC7_Q4: U9.7(DB4) U13.9(4Q) U13.13(5D)
DAC7_Q5: U9.6(DB5) U13.12(5Q) U13.14(6D)
DAC7_Q6: U9.5(DB6) U13.15(6Q) U13.17(7D)
DAC7_Q7: U9.4(DB7_(MSB)) U13.16(7Q) U13.18(8D)
DAC8_Q1: U8.10(DB1) U12.2(1Q) U12.4(2D)
DAC8_Q2: U8.9(DB2) U12.5(2Q) U12.7(3D)
DAC8_Q3: U8.8(DB3) U12.6(3Q) U12.8(4D)
DAC8_Q4: U8.7(DB4) U12.9(4Q) U12.13(5D)
DAC8_Q5: U8.6(DB5) U12.12(5Q) U12.14(6D)
DAC8_Q6: U8.5(DB6) U12.15(6Q) U12.17(7D)
DAC8_Q7: U8.4(DB7_(MSB)) U12.16(7Q) U12.18(8D)
in.t: U19.11(DB0_(LSB)) U23.3(1D) ; port in.t-ShiftsDACs
NetB8_3: B20.3(G) Q20.3(G) U12.19(8Q) ; port out64.t-ShiftsDACs
NetB20_6: B20.6(D_4) Q20.6(D_4)
NetB21_3: B21.3(G) Q21.3(G) ; port reset-ShiftsDACs
NetB21_6: B21.6(D_4) Q21.6(D_4) U12.1(~{CLR}) U13.1(~{CLR}) U14.1(~{CLR}) U15.1(~{CLR}) U23.1(~{CLR}) U24.1(~{CLR}) U25.1(~{CLR}) U26.1(~{CLR})
NetU4_4: U12.11(CLK) U16.2(A) ; port in.buf-ShiftsDACs
NetU8_11: U8.11(DB0_(LSB)) U12.3(1D) U13.19(8Q)
NetU9_11: U9.11(DB0_(LSB)) U13.3(1D) U14.19(8Q)
NetU10_11: U10.11(DB0_(LSB)) U14.3(1D) U15.19(8Q)
NetU11_11: U11.11(DB0_(LSB)) U15.3(1D) U26.19(8Q)
NetU13_11: U13.11(CLK) U16.4(Y) U17.2(A)
NetU14_11: U14.11(CLK) U17.4(Y) U18.2(A)
NetU15_11: U15.11(CLK) U18.4(Y) U30.2(A)
NetU20_11: U20.11(DB0_(LSB)) U23.19(8Q) U24.3(1D)
NetU21_11: U21.11(DB0_(LSB)) U24.19(8Q) U25.3(1D)
NetU22_11: U22.11(DB0_(LSB)) U25.19(8Q) U26.3(1D)
NetU23_11: U23.11(CLK) U27.4(Y)
NetU24_11: U24.11(CLK) U27.2(A) U28.4(Y)
NetU25_11: U25.11(CLK) U28.2(A) U29.4(Y)
NetU26_11: U26.11(CLK) U29.2(A) U30.4(Y)

Not connected (* = marked no-connect by the designer): B20 1(D_1)* 2(D_2)* 5(D_3)*; B21 1(D_1)* 2(D_2)* 5(D_3)*; Q20 1(D_1)* 2(D_2)* 5(D_3)*; Q21 1(D_1)* 2(D_2)* 5(D_3)*; U8 1(OUT1)* 12(~{CS})* 13(~{WR})* 16(RFB)*; U9 1(OUT1)* 12(~{CS})* 13(~{WR})* 16(RFB)*; U10 1(OUT1)* 12(~{CS})* 13(~{WR})* 16(RFB)*; U11 1(OUT1)* 12(~{CS})* 13(~{WR})* 16(RFB)*; U16 1(NC)*; U17 1(NC)*; U18 1(NC)*; U19 1(OUT1)* 12(~{CS})* 13(~{WR})* 16(RFB)*; U20 1(OUT1)* 12(~{CS})* 13(~{WR})* 16(RFB)*; U21 1(OUT1)* 12(~{CS})* 13(~{WR})* 16(RFB)*; U22 1(OUT1)* 12(~{CS})* 13(~{WR})* 16(RFB)*; U27 1(NC)*; U28 1(NC)*; U29 1(NC)*; U30 1(NC)*

### Buses and harness runs
bus DAC1_Q[7..1]
bus DAC2_Q[7..1]
bus DAC3_Q[7..1]
bus DAC4_Q[7..1]
bus DAC5_Q[7..1]
bus DAC6_Q[7..1]
bus DAC7_Q[7..1]
bus DAC8_Q[7..1]

### Library data of the parts
B20 B21 = CMP-007-000000-1: as B1 on sheet Main; Datasheet Link: https://www.onsemi.com/pub/Collateral/FDC638P-D.PDF; Arrow Price/Stock: *; Design Item ID: FDC638P; Mouser Part Number: 512-FDC638P; Manufacturer_Part_Number: FDC638P; Mouser Price/Stock: https://www.mouser.co.uk/ProductDetail/onsemi-Fairchild/FDC638P?qs=FOlmdCx%252BAA16kOuf%252Brkheg%3D%3D; Source: FDC638P.SchLib; Arrow Part Number: *
Q20 Q21 = CMP-005-000000-4: as Q1 on sheet Main; Mouser Part Number: 512-FDC637AN; Source: FDC637AN.SchLib; Arrow Part Number: FDC637AN; Datasheet Link: https://www.onsemi.com/pub/Collateral/FDC637AN-D.PDF; Arrow Price/Stock: https://www.arrow.com/en/products/fdc637an/on-semiconductor?region=nac; Manufacturer_Part_Number: FDC637AN; Mouser Price/Stock: https://www.mouser.co.uk/ProductDetail/ON-Semiconductor-Fairchild/FDC637AN?qs=utFvTgNEmG6iAEUdTAueXw%3D%3D; Design Item ID: FDC637AN
U8-U11 U19-U22 = CMP-0004-00907-1: 8-Bit, 0.1 us MDAC, Parallel Input, Fast Control Signalling for DSP, Easy Micro Interface, 0 to 70 degC, 16-pin DIP (N16), Pb-Free (RoHS); Manufacturer: Texas Instruments; INL(Max)(+/-LSB): 0.5; Settling Time(us): 0.1; DAC Channels: 1; Resolution(Bits): 8; SubFamily: Precision DAC (=<10MSPS); ComponentLink2URL: http://www.ti.com/general/docs/lit/getliterature.tsp?genericPartNumber=TLC7524&fileType=pdf; ComponentLink2Description: Datasheet; ComponentLink3Description: Package Specification; PackageReference: N16; Code_JEDEC: MS-001; ComponentLink1Description: Manufacturer URL; DatasheetVersion: SLAS061D; PartNumber: TLC7524CN; Interface: Parallel; ComponentLink3URL: http://www.ti.com/litv/pdf/mpdi002c; Eco-Plan: Pb-Free (RoHS); Mounting Technology: Through Hole; PackageVersion: 4040049/E, 12/2002; DNL(Max)(+/-LSB): 0.5; ComponentLink1URL: http://www.ti.com/; PackageDescription: 16-Pin Plastic In-Line, Body 19.305 x 6.35 mm, Pitch 2.54 mm
U12-U15 U23-U26 = CMP-00023-00003-2: D Flip-Flop, HC/UH Series, 1-Func, Positive Edge Triggered, 8-Bit, True Output, CMOS, PDSO20; Pins: 20; Case/Package: SOP; RoHS Compliant: Yes; Min Operating Temperature: -40°C; Max Operating Temperature: 85°C
U16-U18 U27-U30 = CMP-00023-00004-1: as U2 on sheet Main; Min Operating Temperature: -40°C; Pins: 5; Case/Package: TSSOP; Max Operating Temperature: 125°C; RoHS Compliant: Yes

## Sheet Muller-C1(2).SchDoc
size 429 x 344 mm
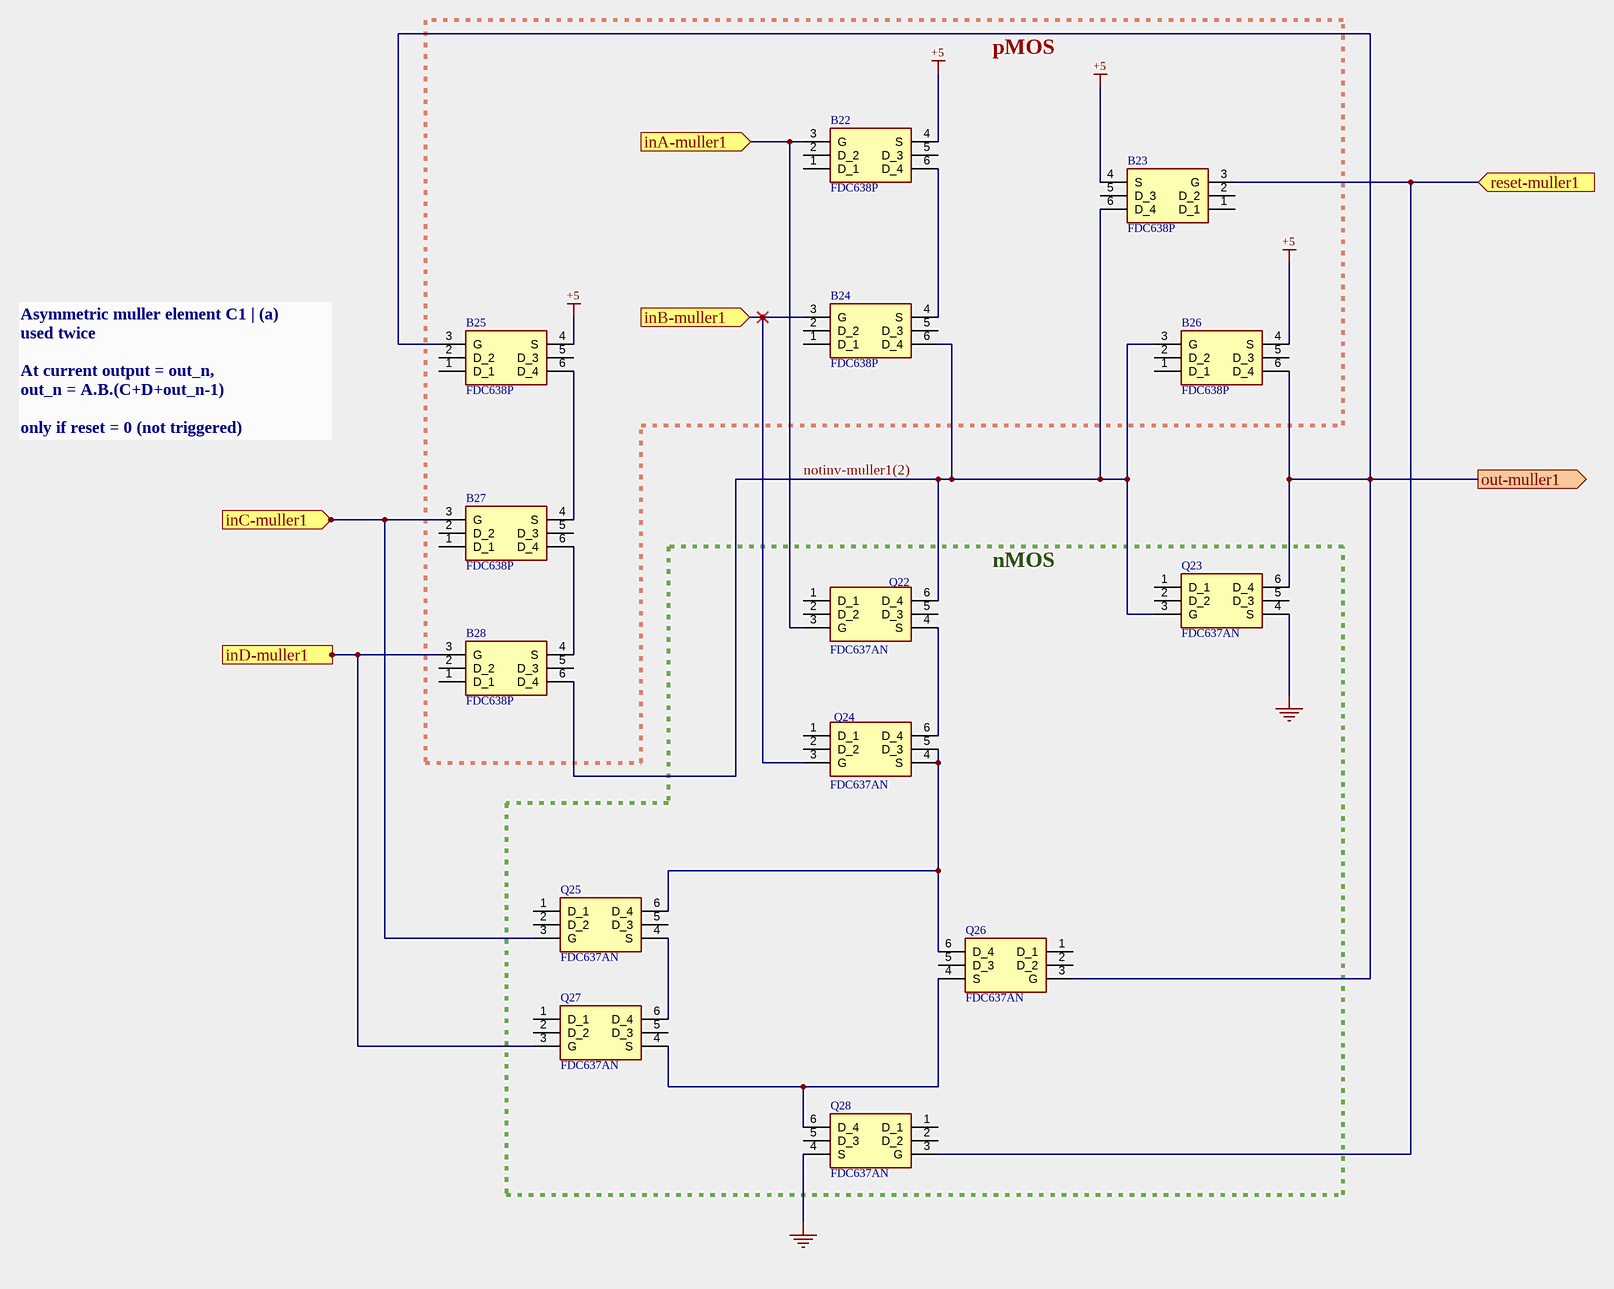
[diagram p5: Muller-C1(2).SchDoc]

### Parts
B22  FDC638P  [SOT95P275X110-6N]
B23  FDC638P  [SOT95P275X110-6N]
B24  FDC638P  [SOT95P275X110-6N]
B25  FDC638P  [SOT95P275X110-6N]
B26  FDC638P  [SOT95P275X110-6N]
B27  FDC638P  [SOT95P275X110-6N]
B28  FDC638P  [SOT95P275X110-6N]
Q22  FDC637AN  [SOT95P275X110-6N]
Q23  FDC637AN  [SOT95P275X110-6N]
Q24  FDC637AN  [SOT95P275X110-6N]
Q25  FDC637AN  [SOT95P275X110-6N]
Q26  FDC637AN  [SOT95P275X110-6N]
Q27  FDC637AN  [SOT95P275X110-6N]
Q28  FDC637AN  [SOT95P275X110-6N]

### Blocks framed on the sheet
pMOS: B22-B28
nMOS: Q22-Q28

### Ports
inA-muller1 (in), inB-muller1 (in), inC-muller1 (in), inD-muller1 (in), out-muller1 (out), reset-muller1 (in)

### Nets
+5: B22.4(S) B23.4(S) B25.4(S) B26.4(S)  [project net VBUS-USBC]
GND: Q23.4(S) Q28.4(S)  [project net Dn-USBC]
notinv-muller1(2): B23.6(D_4) B24.6(D_4) B26.3(G) B28.6(D_4) Q22.6(D_4) Q23.3(G)
RESET_OUT: B23.3(G) Q28.3(G) ; port reset-muller1
NetB2_3: B22.3(G) Q22.3(G) ; port inA-muller1
NetB4_3: B27.3(G) Q25.3(G) ; port inC-muller1
NetB7_3: B28.3(G) Q27.3(G) ; port inD-muller1
NetB22_6: B22.6(D_4) B24.4(S)
NetB24_3: B24.3(G) Q24.3(G) ; port inB-muller1
NetB25_3: B25.3(G) B26.6(D_4) Q23.6(D_4) Q26.3(G) ; port out-muller1
NetB25_6: B25.6(D_4) B27.4(S)
NetB27_6: B27.6(D_4) B28.4(S)
NetQ22_4: Q22.4(S) Q24.6(D_4)
NetQ24_4: Q24.4(S) Q24.5(D_3) Q25.6(D_4) Q26.6(D_4)
NetQ25_4: Q25.4(S) Q27.6(D_4)
NetQ26_4: Q26.4(S) Q27.4(S) Q28.6(D_4)

Not connected (* = marked no-connect by the designer): B22 1(D_1) 2(D_2) 5(D_3); B23 1(D_1) 2(D_2) 5(D_3); B24 1(D_1) 2(D_2) 5(D_3); B25 1(D_1) 2(D_2) 5(D_3); B26 1(D_1) 2(D_2) 5(D_3); B27 1(D_1) 2(D_2) 5(D_3); B28 1(D_1) 2(D_2) 5(D_3); Q22 1(D_1) 2(D_2) 5(D_3); Q23 1(D_1) 2(D_2) 5(D_3); Q24 1(D_1) 2(D_2); Q25 1(D_1) 2(D_2) 5(D_3); Q26 1(D_1) 2(D_2) 5(D_3); Q27 1(D_1) 2(D_2) 5(D_3); Q28 1(D_1) 2(D_2) 5(D_3)

### Notes on the sheet
- Asymmetric muller element C1 | (a)
  used twice
  At current output = out_n,
  out_n = A.B.(C+D+out_n-1)
  only if reset = 0 (not triggered)

### Library data of the parts
B22-B28 = CMP-007-000000-1: as B1 on sheet Main; Datasheet Link: https://www.onsemi.com/pub/Collateral/FDC638P-D.PDF; Arrow Price/Stock: *; Design Item ID: FDC638P; Mouser Part Number: 512-FDC638P; Manufacturer_Part_Number: FDC638P; Mouser Price/Stock: https://www.mouser.co.uk/ProductDetail/onsemi-Fairchild/FDC638P?qs=FOlmdCx%252BAA16kOuf%252Brkheg%3D%3D; Source: FDC638P.SchLib; Arrow Part Number: *
Q22-Q28 = CMP-005-000000-4: as Q1 on sheet Main; Mouser Part Number: 512-FDC637AN; Source: FDC637AN.SchLib; Arrow Part Number: FDC637AN; Datasheet Link: https://www.onsemi.com/pub/Collateral/FDC637AN-D.PDF; Arrow Price/Stock: https://www.arrow.com/en/products/fdc637an/on-semiconductor?region=nac; Manufacturer_Part_Number: FDC637AN; Mouser Price/Stock: https://www.mouser.co.uk/ProductDetail/ON-Semiconductor-Fairchild/FDC637AN?qs=utFvTgNEmG6iAEUdTAueXw%3D%3D; Design Item ID: FDC637AN

## Sheet Power.SchDoc
size A4
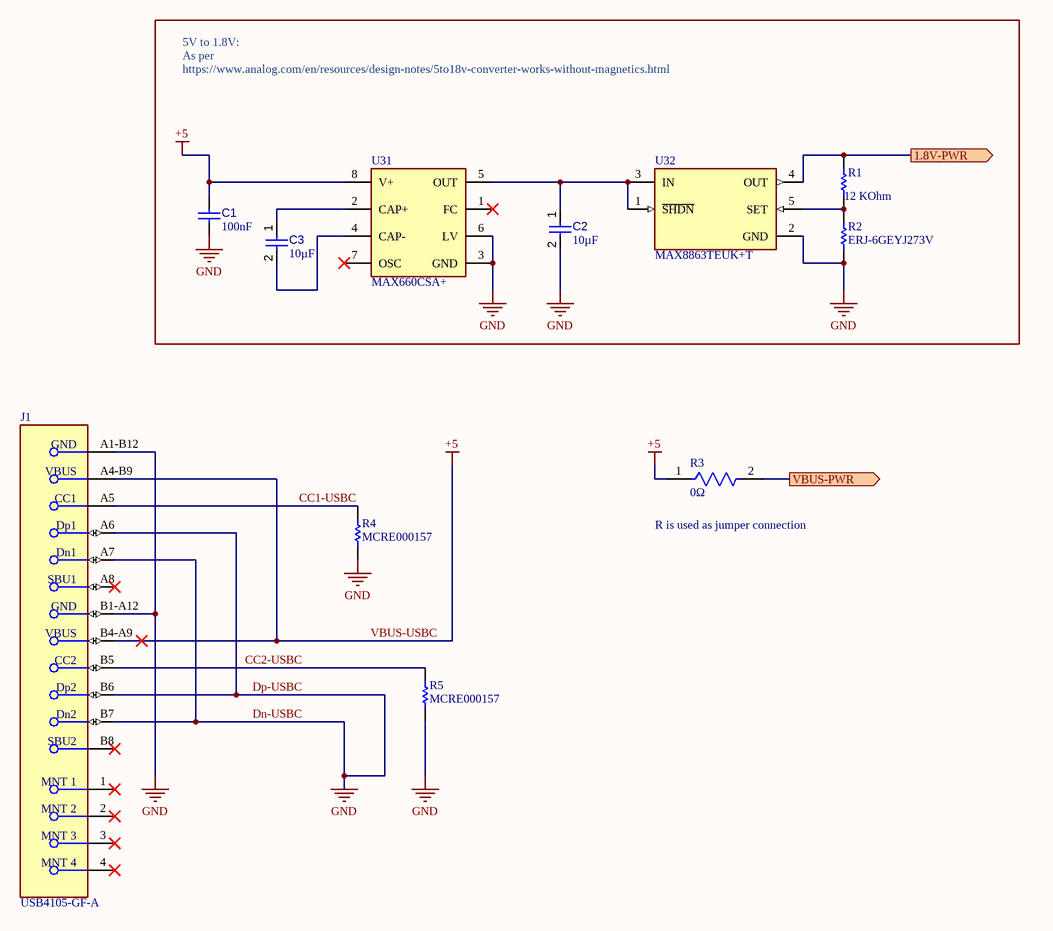
[diagram p6: Power.SchDoc]

### Parts
C1  value 100nF  [CAPC1005X56X25LL10T15]  (hidden comment: Capacitor 0.1 uF +/- 5% 16 V 0402)
C2  value 10µF  [CAPC2013X135X45NL10T25]  (hidden comment: Capacitor 10 uF +/- 10% 16 V 0805)
C3  value 10µF  [CAPC2013X135X45NL10T25]  (hidden comment: Capacitor 10 uF +/- 10% 16 V 0805)
J1  USB4105-GF-A  [FP-USB4105-GF-A-MFG]
R1  Resistance: 12 KOhm  [RESC1005X40X25ML05T05]  (hidden comment: ERJ-2RKF1202X)
R2  ERJ-6GEYJ273V  [RESC2013X70X40NL20T20]
R3  0Ω  [FP-CRCW1206-C-e3-MFG]
R4  MCRE000157  [RESC0603X26X15NL03T05]
R5  MCRE000157  [RESC0603X26X15NL03T05]
U31  MAX660CSA+  [FP-S8-4-MFG]
U32  MAX8863TEUK+T  [FP-U5-1-IPC_C]

### Ports
1.8V-PWR (out), VBUS-PWR (out)

### Nets
1.8V: R1.1 U32.4(OUT) ; port 1.8V-PWR
Dn-USBC: C1.2 C2.2 J1.A1-B12(GND) J1.A6(Dp1) J1.A7(Dn1) J1.B1-A12(GND) J1.B6(Dp2) J1.B7(Dn2) R2.2 R4.2 R5.2 U31.3(GND) U31.6(LV) U32.2(GND)  [also labelled Dp-USBC, GND]
VBUS-USBC: C1.1 J1.A4-B9(VBUS) J1.B4-A9(VBUS) R3.1 R3.2 U31.8(V+) ; port VBUS-PWR  [also labelled +5]
CC1-USBC: J1.A5(CC1) R4.1
CC2-USBC: J1.B5(CC2) R5.1
NetC2_1: C2.1 U31.5(OUT) U32.1(~{SHDN}) U32.3(IN)
NetC3_1: C3.1 U31.2(CAP+)
NetC3_2: C3.2 U31.4(CAP-)
NetR1_2: R1.2 R2.1 U32.5(SET)

Not connected (* = marked no-connect by the designer): J1 1(MNT_1)* 2(MNT_2)* 3(MNT_3)* 4(MNT_4)* A8(SBU1)* B8(SBU2)*; U31 1(FC)* 7(OSC)*

### Notes on the sheet
- 5V to 1.8V:
  As per https://www.analog.com/en/resources/design-notes/5to18v-converter-works-without-magnetics.html
- Type @ to refer to a designator
- (near R3) R is used as jumper connection

### Library data of the parts
C1 = CMP-001-00001-6: Chip Capacitor, 0.1 uF, +/- 5%, 16 V, 0402 (1005 Metric); Capacitor Type: Ceramic; Voltage Rating: 16V; Max Operating Temperature: 125°C; Min Operating Temperature: -55°C; Case/Package: 0402; Mounting Technology: SM; Pins: 2; Tolerance: 5%; RoHS Compliant: True
C2 C3 = CMP-001-00015-6: Chip Capacitor, 10 uF, +/- 10%, 16 V, 0805 (2012 Metric); Voltage Rating: 16V; Capacitor Type: Ceramic; RoHS Compliant: True; Max Operating Temperature: 85°C; Min Operating Temperature: -55°C; Mounting Technology: SM; Tolerance: 10%; Case/Package: 0805; Pins: 2
J1 = CMP-245163-000001-1: CONN RCPT USB2.0 TYPEC 5A; Manufacturer: GCT; Description: USB - C (Type - C) USB 2.0 Receptacle Connector 24 Position Surface Mount, Right Angle; Through Hole; Voltage Rating: 20V; Is Female: yes; Current Rating: 5/6.25/1.25/0.25A; Number Of Contacts: 16; Conn Orientation: Right Angle; Device Class L1: Connectors; Category: Conn; Lead Free: Yes; RoHS: TRUE; Temperature Range High: +85°C; Digikey Description: CONN RCPT USB2.0 TYPEC 5A; Device Class L3: unset; ComponentLink2Description: Datasheet; Manufacturer Part Number: USB4105-GF-A; Package: 0; Usb Standard: USB 2.0; Device Class L2: USB Connectors; Automotive: No; Temperature Range Low: -40°C; Height: 3.46mm; Temperature: -40°C to +85°C; Contact Material: Gold,Nickel; ComponentLink2URL: https://gct.co/files/drawings/usb4105.pdf; Octopart: https://octopart.com/usb4105-gf-a-gct-106627878
R1 = CMP-2002-00646-4: Chip Resistor, 12 KOhm, +/- 1%, 0.1 W, -55 to 155 degC, 0402 (1005 Metric), RoHS, Tape and Reel; Voltage Rating: 50 V; Case\/Package: 0402; Power Rating: 100 mW; Length: 1 mm; PackageReference: 0402; DatasheetVersion: 04/2015; ComponentLink2Description: Datasheet; ComponentLink1URL: http://www.panasonic.com/; Pins: 2; Width: 0.5 mm; REACH SVHC: Yes; Packaging: Tape and Reel; Min Operating Temperature: -55 degC; Mounting Technology: Surface Mount; Max Operating Temperature: 155 degC; Case Code (Imperial): 0402; Height: 0.35 mm; Tolerance: 1%; PackageDescription: 2-Pin Surface Mount Device, Body 1 x 0.5 mm; RoHSCompliant: true; ComponentLink1Description: Manufacturer URL; Mount: Surface Mount; ComponentLink2URL: http://industrial.panasonic.com/cdbs/www-data/pdf/RDA0000/AOA0000C86.pdf; Package Quantity: 10000; Case Code (Metric): 1005; PartNumber: ERJ-2RKF1202X
R2 = CMP-2001-00388-1: Manufacturer: Panasonic; Part Number: ERJ-6GEYJ273V
R3 = CMP-02407-011547-1: CRCW12060000Z0EAC - RES 0 OHM JUMPER 1/4W 1206; Resistance: 20R; Power Rating: 250mW; Mount: Surface Mount; Contact Plating: Tin; Min Operating Temperature: -55°C; Case/Package: Molded; Lead Free: Lead Free; RoHS Compliant: Yes; Length: 3.2mm; Max Operating Temperature: 155°C; Termination: Wraparound; Resistor Type: Thick Film
R4 R5 = CMP-2004-02525-1: Manufacturer: Multicomp; Part Number: MCRE000157
U31 = CMP-05722-000124-1: IC REG CHARGE PUMP INV 8SOIC; Manufacturer: Maxim Integrated; Description: IC REG SWTCHD CAP INV 0.1A 8SOIC; Max Supply Voltage: 5.5V; Min Supply Voltage: 1.5V; Max Power Dissipation: 471mW; Switching Frequency: 10/80kHz; Output Voltage: -5.5/+11V; Output Type: Other; Number Of Outputs: 1; Standoff Height: 0.1mm; Output Current: 100mA; Negative Voltage Available: true; Nominal Supply Current: 0.12-1mA; Device Class L2: Power Management ICs; Switching Topology: Charge Pump; Height: 1.75mm; ComponentLink2URL: https://datasheets.maximintegrated.com/en/ds/MAX660.pdf; Category: IC; Temperature Range High: +70°C; RoHS: TRUE; Temperature Range Low: 0°C; Mouser Description: Switching Voltage Regulators CMOS Monolithic Voltage Converter; ComponentLink2Description: Datasheet; Device Class L1: Integrated Circuits (ICs); Package: S8-4; Manufacturer Part Number: MAX660CSA+; Octopart: https://octopart.com/max660csa%2B-maxim+integrated-39436905; Footprint Url: https://pdfserv.maximintegrated.com/land_patterns/90-0096.PDF; Device Class L3: Voltage Regulators - Switching; Temperature: 0°C to +70°C; Lead Free: Yes; Automotive: No; Digikey Description: IC REG CHARGE PUMP INV 8SOIC
U32 = CMP-05721-000030-1: IC REG LIN POS ADJ 120MA SOT23-5; Min Input Voltage: 2.5V; Max Power Dissipation: 571mW; Output Voltage: 6.5V; Reference Voltage: 1.275V; Output Type: Fixed; Polarity: Positive; Number of Outputs: 1; Input Bias Current: 80uA; Nominal Output Voltage: 3.15V; Dropout Voltage: 55mV; Min Operating Temperature: -40°C; Lead Free: Lead Free; Radiation Hardening: No; Case/Package: SOT-23; Output Current: 120mA; Mount: Surface Mount; Max Input Voltage: 6.5V; Series: -; Package Quantity: 1; RoHS Compliant: Yes; Number of Regulators: 1; Packaging: Tape and Reel; Max Operating Temperature: 85°C; Number of Pins: 5

## Sheet Varistors.SchDoc
size A4
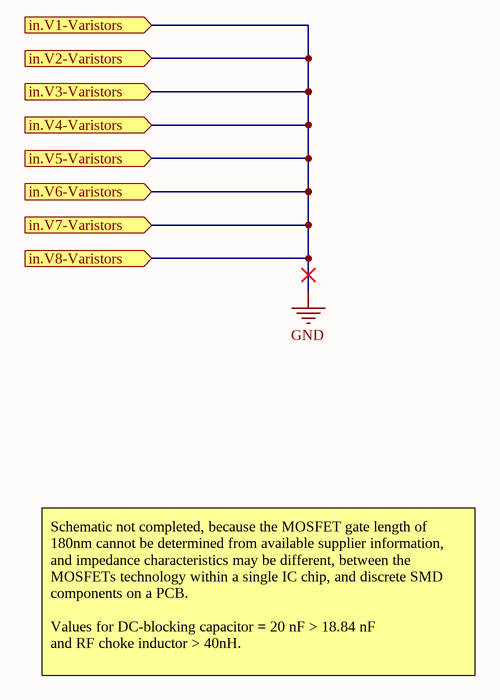
[diagram p7: Varistors.SchDoc]

### Ports
in.V1-Varistors (in), in.V2-Varistors (in), in.V3-Varistors (in), in.V4-Varistors (in), in.V5-Varistors (in), in.V6-Varistors (in), in.V7-Varistors (in), in.V8-Varistors (in)

### Nets
GND: port in.V1-Varistors, port in.V2-Varistors, port in.V3-Varistors, port in.V4-Varistors, port in.V5-Varistors, port in.V6-Varistors, port in.V7-Varistors, port in.V8-Varistors  [project net Dn-USBC]

### Notes on the sheet
- Schematic not completed, because the MOSFET gate length of 180nm cannot be determined from available supplier information, and impedance characteristics may be different, between the MOSFETs technology within a single IC chip, and discrete SMD components on a PCB.
  Values for DC-blocking capacitor = 20 nF > 18.84 nF
  and RF choke inductor > 40nH.

## Nets that join several sheets
1.8V: Shifts-DACs (8 pins), Power (R1.1 U32.4)
Dn-USBC: Main (8 pins), Muller-C1 (Q3.4 Q8.4), Muller-C2 (Q9.4 Q11.4 Q12.4), Muller-C3 (Q13.4 Q19.4), Shifts-DACs (33 pins), Muller-C1(2) (Q23.4 Q28.4), Power (14 pins)
VBUS-USBC: Main (6 pins), Muller-C1 (B2.4 B3.4 B5.4 B6.4), Muller-C2 (B9.4 B12.4), Muller-C3 (B13.4 B14.4 B16.4 B18.4), Shifts-DACs (25 pins), Muller-C1(2) (B22.4 B23.4 B25.4 B26.4), Power (6 pins)
in.a: Main (B1.3 J3.1 Q1.3), Muller-C2 (B9.3 Q11.2), Muller-C3 (B13.3 Q14.3)
in.t: Main (J2.1 U1.1), Shifts-DACs (U19.11 U23.3)
NetB2_3: Main (U3.4), Muller-C1 (B2.3 Q2.3), Muller-C1(2) (B22.3 Q22.3)
NetB4_3: Muller-C1 (B4.3 Q4.3), Muller-C2 (B10.3 B12.6 Q9.6 Q12.3), Muller-C3 (B15.3 Q15.3), Muller-C1(2) (B27.3 Q25.3)
NetB5_3: Main (U2.2), Muller-C1 (B5.3 B6.6 Q3.6 Q6.3)
NetB7_3: Main (U1.4 U4.2), Muller-C1 (B7.3 Q5.3), Muller-C3 (B17.3 Q16.3), Muller-C1(2) (B28.3 Q27.3)
NetB8_3: Muller-C1 (B8.3 Q7.3), Shifts-DACs (B20.3 Q20.3 U12.19)
NetB21_3: Main (U6.4), Shifts-DACs (B21.3 Q21.3)
NetB25_3: Main (U5.2), Muller-C1(2) (B25.3 B26.6 Q23.6 Q26.3)
NetU4_4: Main (U4.4), Shifts-DACs (U12.11 U16.2)
out.a: Main (J5.1), Muller-C2 (B11.3 Q10.3), Muller-C3 (B14.3 B18.6 Q13.6 Q18.2)
RESET_OUT: Main (U7.4), Muller-C1 (B3.3 Q8.3), Muller-C3 (B16.3 B19.3 Q17.3 Q19.3), Muller-C1(2) (B23.3 Q28.3)